# EAGLE design VSCard (EAGLE 8.3.1)
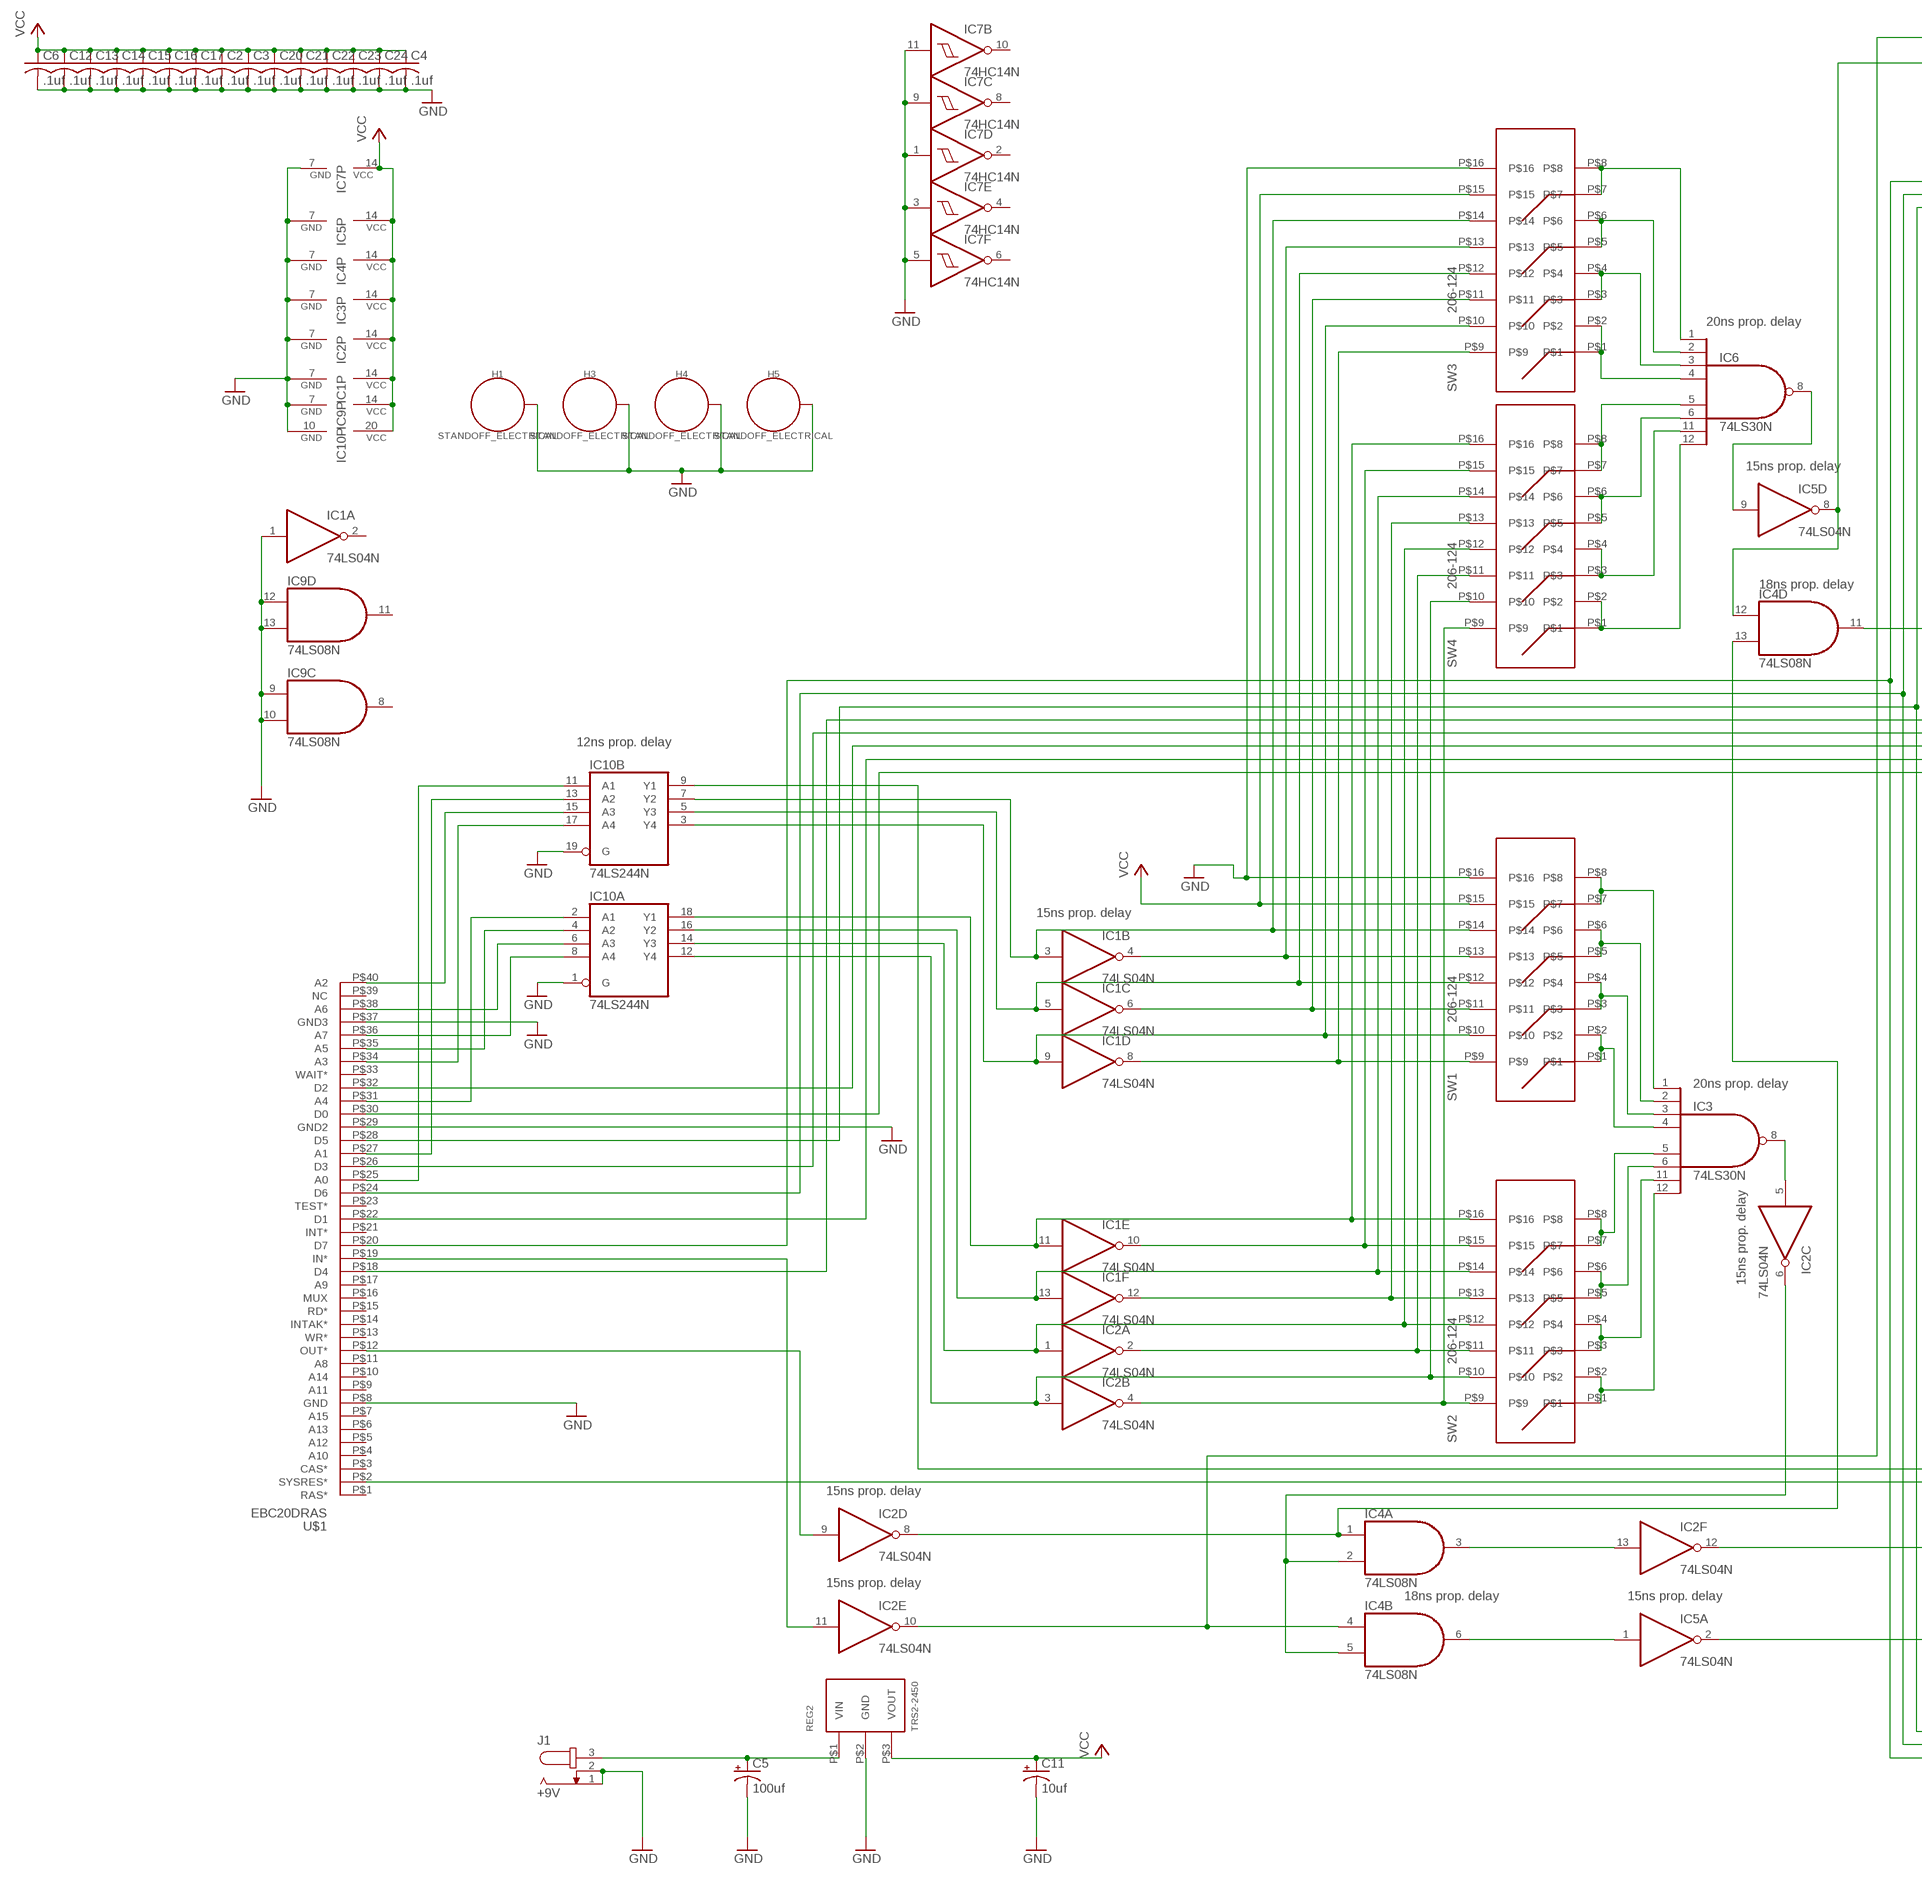
[diagram p0: schematic, sheet 1, part 1 of 3]
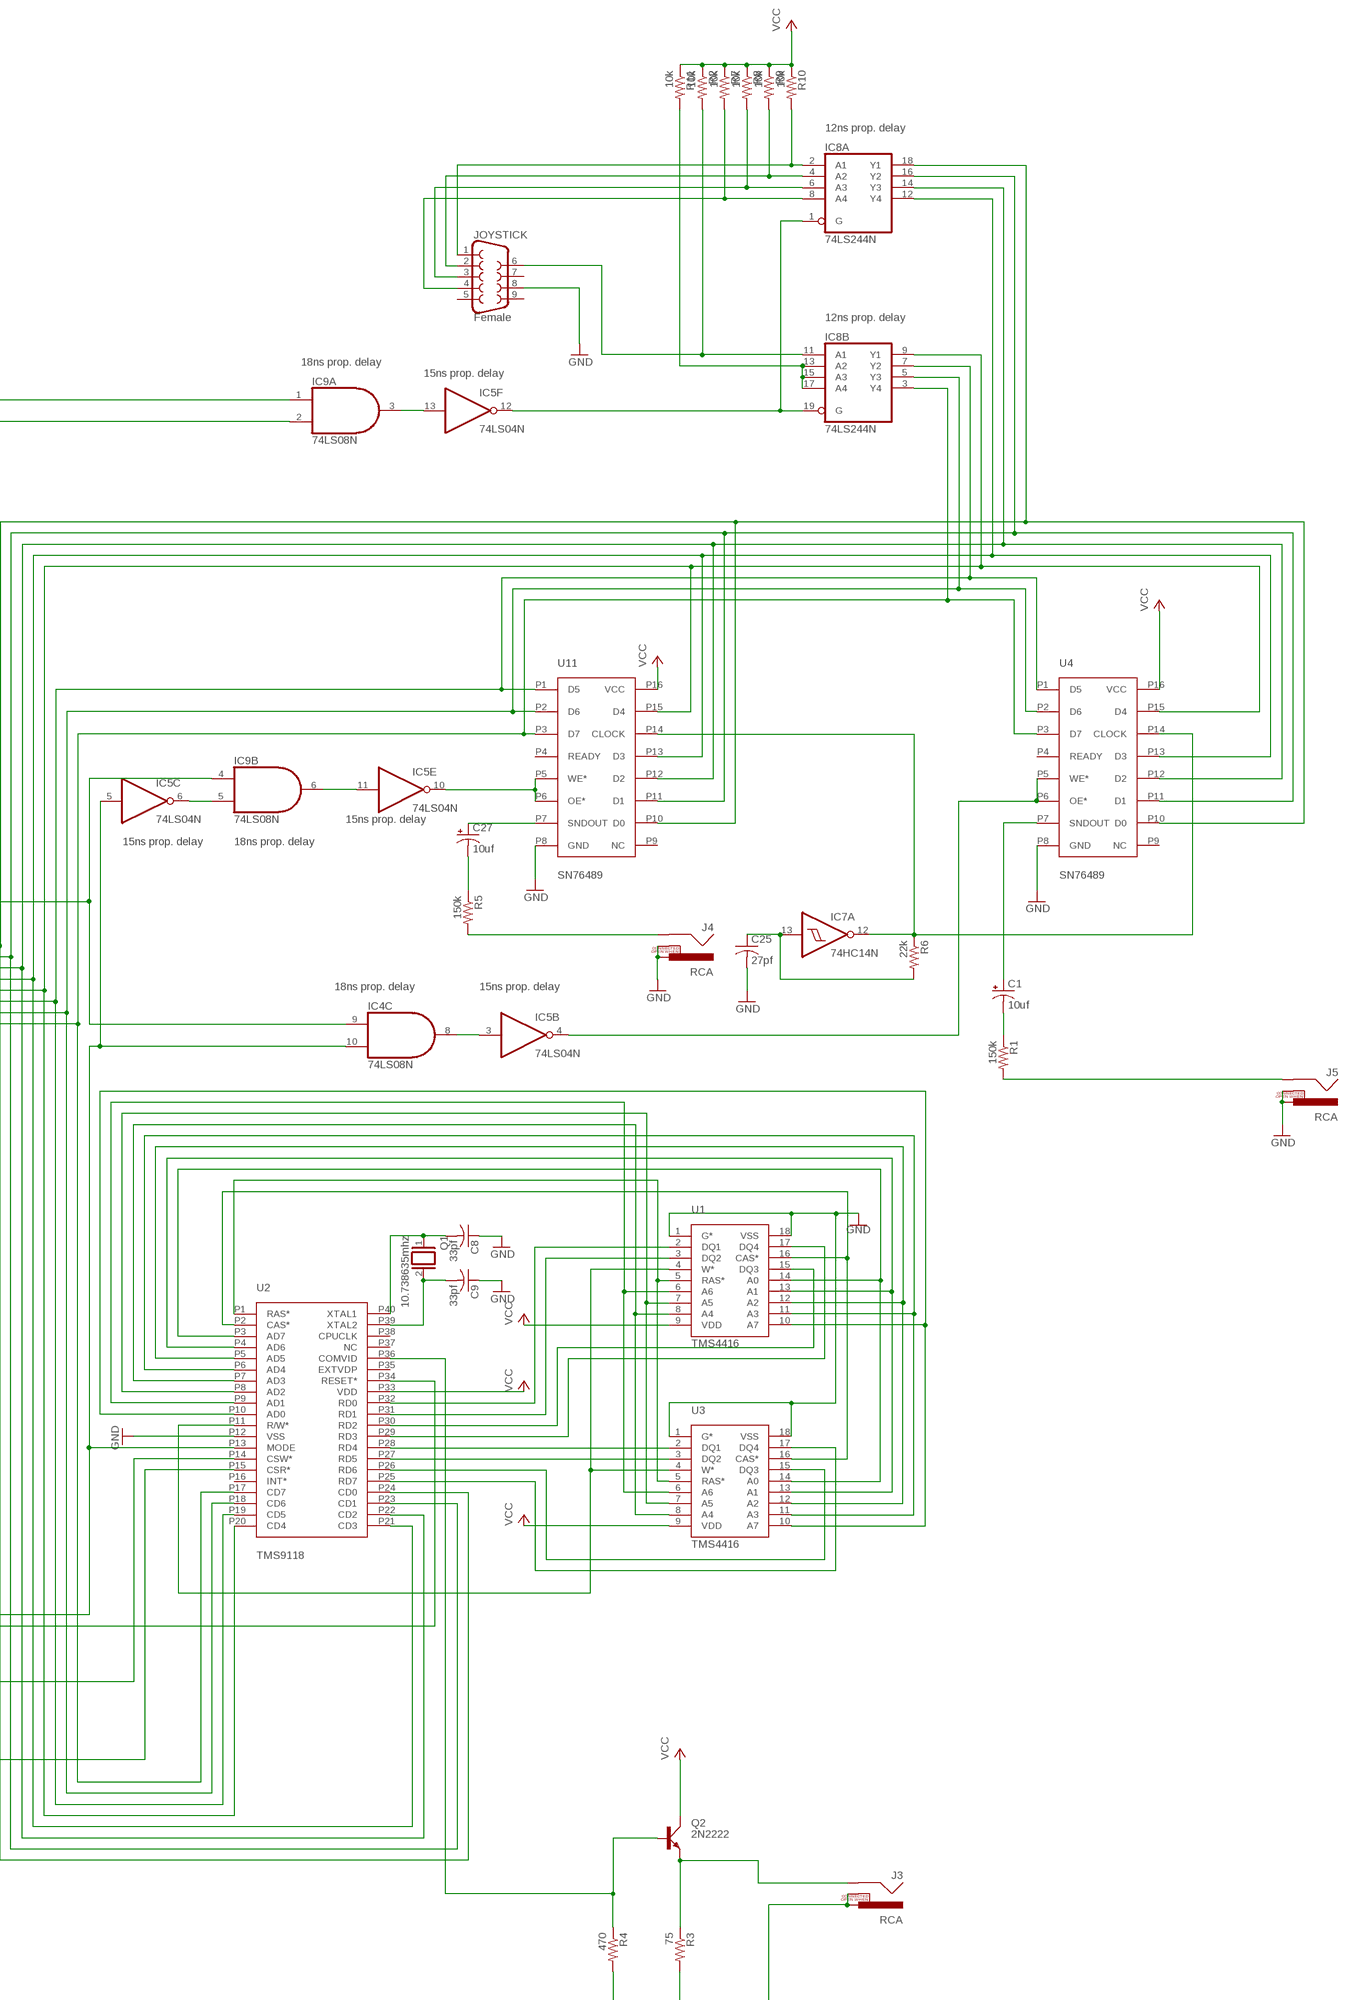
[diagram p1: schematic, sheet 1, part 2 of 3]
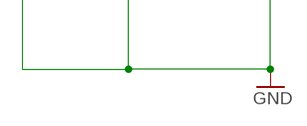
[diagram p2: schematic, sheet 1, part 3 of 3]

## Parts
C1  10uf  CPOL-USE2.5-6  [E2,5-6]
C2  .1uf  C-US025-025X050  [C025-025X050]
C3  .1uf  C-US025-025X050  [C025-025X050]
C4  .1uf  C-US025-025X050  [C025-025X050]
C5  100uf  CPOL-USE3.5-10  [E3,5-10]
C6  .1uf  C-US025-025X050  [C025-025X050]
C8  33pf  C-US050-050X075  [C050-050X075]
C9  33pf  C-US050-050X075  [C050-050X075]
C11  10uf  CPOL-USE3.5-10  [E3,5-10]
C12  .1uf  C-US025-025X050  [C025-025X050]
C13  .1uf  C-US025-025X050  [C025-025X050]
C14  .1uf  C-US025-025X050  [C025-025X050]
C15  .1uf  C-US025-025X050  [C025-025X050]
C16  .1uf  C-US025-025X050  [C025-025X050]
C17  .1uf  C-US025-025X050  [C025-025X050]
C20  .1uf  C-US025-025X050  [C025-025X050]
C21  .1uf  C-US025-025X050  [C025-025X050]
C22  .1uf  C-US025-025X050  [C025-025X050]
C23  .1uf  C-US025-025X050  [C025-025X050]
C24  .1uf  C-US025-025X050  [C025-025X050]
C25  27pf  C-US025-025X050  [C025-025X050]
C27  10uf  CPOL-USE2.5-6  [E2,5-6]
H1  STANDOFF_ELECTRICAL  [STANDOFF-ELECTRICAL]
H3  STANDOFF_ELECTRICAL  [STANDOFF-ELECTRICAL]
H4  STANDOFF_ELECTRICAL  [STANDOFF-ELECTRICAL]
H5  STANDOFF_ELECTRICAL  [STANDOFF-ELECTRICAL]
IC1  74LS04N  [DIL14]
IC2  74LS04N  [DIL14]
IC3  74LS30N  [DIL14]
IC4  74LS08N  [DIL14]
IC5  74LS04N  [DIL14]
IC6  74LS30N  [DIL14]
IC7  74HC14N  [DIL14]
IC8  74LS244N  [DIL20]
IC9  74LS08N  [DIL14]
IC10  74LS244N  [DIL20]
J1  +9V  JACK-PLUG0  [SPC4077]
J3  RCA  [RCA]
J4  RCA  [RCA]
J5  RCA  [RCA]
JOYSTICK  Female  DB9FEMALE  [DB9]
Q1  10.738635mhz  XTAL/S  [QS]
Q2  2N2222  [TO18A]
R1  150k  R-US_0207/2V  [0207/2V]
R2  10k  R-US_0207/2V  [0207/2V]
R3  75  R-US_0207/2V  [0207/2V]
R4  470  R-US_0207/2V  [0207/2V]
R5  150k  R-US_0207/2V  [0207/2V]
R6  22k  R-US_0207/2V  [0207/2V]
R7  10k  R-US_0207/2V  [0207/2V]
R8  10k  R-US_0207/2V  [0207/2V]
R9  10k  R-US_0207/2V  [0207/2V]
R10  10k  R-US_0207/2V  [0207/2V]
R11  10k  R-US_0207/2V  [0207/2V]
REG2  TRS2-2450  [TRACON_REG]
SW1  206-124  [206-124]
SW2  206-124  [206-124]
SW3  206-124  [206-124]
SW4  206-124  [206-124]
U1  TMS4416  [DIP18]
U2  TMS9118  [DIP40_MCU]
U3  TMS4416  [DIP18]
U4  SN76489  [DIP16]
U11  SN76489  [DIP16]
U$1  EBC20DRAS  [EBC20DRAS]

## Nets
A0: IC10.11(B:A1) U$1.P$25(A0)
A0(*): IC5.6(C:O) IC9.5(B:I1)
A0-SETTING: IC6.1(I0) SW3.P$7 SW3.P$8
A0-VDP-SETTING: IC3.1(I0) SW1.P$7 SW1.P$8
A0_BUFFERED: IC4.10(C:I1) IC5.5(C:I) IC10.9(B:Y1) U2.P13(MODE)
A1: IC10.13(B:A2) U$1.P$27(A1)
A1(*): IC1.4(B:O) SW1.P$13 SW3.P$13
A1-SETTING: IC6.2(I1) SW3.P$5 SW3.P$6
A1-VDP-SETTING: IC3.2(I1) SW1.P$5 SW1.P$6
A1_BUFFERED: IC1.3(B:I) IC10.7(B:Y2) SW1.P$14 SW3.P$14
A2: IC10.15(B:A3) U$1.P$40(A2)
A2(*): IC1.6(C:O) SW1.P$11 SW3.P$11
A2-SETTING: IC6.3(I2) SW3.P$3 SW3.P$4
A2-VDP-SETTING: IC3.3(I2) SW1.P$3 SW1.P$4
A2_BUFFERED: IC1.5(C:I) IC10.5(B:Y3) SW1.P$12 SW3.P$12
A3: IC10.17(B:A4) U$1.P$34(A3)
A3(*): IC1.8(D:O) SW1.P$9 SW3.P$9
A3-SETTING: IC6.4(I3) SW3.P$1 SW3.P$2
A3-VDP-SETTING: IC3.4(I3) SW1.P$1 SW1.P$2
A3_BUFFERED: IC1.9(D:I) IC10.3(B:Y4) SW1.P$10 SW3.P$10
A4: IC10.2(A:A1) U$1.P$31(A4)
A4(*): IC1.10(E:O) SW2.P$15 SW4.P$15
A4-SETTING: IC6.5(I4) SW4.P$7 SW4.P$8
A4-VDP-SETTING: IC3.5(I4) SW2.P$7 SW2.P$8
A4_BUFFERED: IC1.11(E:I) IC10.18(A:Y1) SW2.P$16 SW4.P$16
A5: IC10.4(A:A2) U$1.P$35(A5)
A5(*): IC1.12(F:O) SW2.P$13 SW4.P$13
A5-SETTING: IC6.6(I5) SW4.P$5 SW4.P$6
A5-VDP-SETTING: IC3.6(I5) SW2.P$5 SW2.P$6
A5_BUFFERED: IC1.13(F:I) IC10.16(A:Y2) SW2.P$14 SW4.P$14
A6: IC10.6(A:A3) U$1.P$38(A6)
A6(*): IC2.2(A:O) SW2.P$11 SW4.P$11
A6-SETTING: IC6.11(I6) SW4.P$3 SW4.P$4
A6-VDP-SETTING: IC3.11(I6) SW2.P$3 SW2.P$4
A6_BUFFERED: IC2.1(A:I) IC10.14(A:Y3) SW2.P$12 SW4.P$12
A7: IC10.8(A:A4) U$1.P$36(A7)
A7(*): IC2.4(B:O) SW2.P$9 SW4.P$9
A7-SETTING: IC6.12(I7) SW4.P$1 SW4.P$2
A7-VDP-SETTING: IC3.12(I7) SW2.P$1 SW2.P$2
A7_BUFFERED: IC2.3(B:I) IC10.12(A:Y4) SW2.P$10 SW4.P$10
COMVID: Q2.B R4.1 U2.P36(COMVID)
COMVID-OUT: J3.SHELL Q2.E R3.1
D0: IC8.3(B:Y4) U2.P17(CD7) U4.P3(D7) U11.P3(D7) U$1.P$30(D0)
D1: IC8.5(B:Y3) U2.P18(CD6) U4.P2(D6) U11.P2(D6) U$1.P$22(D1)
D2: IC8.7(B:Y2) U2.P19(CD5) U4.P1(D5) U11.P1(D5) U$1.P$32(D2)
D3: IC8.9(B:Y1) U2.P20(CD4) U4.P15(D4) U11.P15(D4) U$1.P$26(D3)
D4: IC8.12(A:Y4) U2.P21(CD3) U4.P13(D3) U11.P13(D3) U$1.P$18(D4)
D5: IC8.14(A:Y3) U2.P22(CD2) U4.P12(D2) U11.P12(D2) U$1.P$28(D5)
D6: IC8.16(A:Y2) U2.P23(CD1) U4.P11(D1) U11.P11(D1) U$1.P$24(D6)
D7: IC8.18(A:Y1) U2.P24(CD0) U4.P10(D0) U11.P10(D0) U$1.P$20(D7)
DOWN: IC8.4(A:A2) JOYSTICK.2 R9.2
GND: C2.2 C3.2 C4.2 C5.- C6.2 C8.1 C9.1 C11.- C12.2 C13.2 C14.2 C15.2 C16.2 C17.2 C20.2 C21.2 C22.2 C23.2 C24.2 C25.2 H1.P1 H3.P1 H4.P1 H5.P1 IC1.1(A:I) IC1.7(P:GND) IC2.7(P:GND) IC3.7(GND) IC4.7(P:GND) IC5.7(P:GND) IC7.1(D:I) IC7.3(E:I) IC7.5(F:I) IC7.7(P:GND) IC7.9(C:I) IC7.11(B:I) IC9.7(P:GND) IC9.9(C:I0) IC9.10(C:I1) IC9.12(D:I0) IC9.13(D:I1) IC10.1(A:G) IC10.10(P:GND) IC10.19(B:G) J1.1 J1.2 J3.PIN J3.SWITCH J4.PIN J4.SWITCH J5.PIN J5.SWITCH JOYSTICK.8 R3.2 R4.2 REG2.P$2(GND) SW1.P$16 SW3.P$16 U1.1(G*) U1.18(VSS) U2.P12(VSS) U3.1(G*) U3.18(VSS) U4.P8(GND) U11.P8(GND) U$1.P$8(GND) U$1.P$29(GND2) U$1.P$37(GND3)
IN: IC2.10(E:O) IC4.4(B:I0) IC9.1(A:I0)
IN(*): IC2.11(E:I) U$1.P$19(IN*)
LEFT: IC8.6(A:A3) JOYSTICK.3 R8.2
N$18: U1.5(RAS*) U2.P1(RAS*) U3.5(RAS*)
N$21: U1.16(CAS*) U2.P2(CAS*) U3.16(CAS*)
N$64: C27.- R5.1
N$65: J4.SHELL R5.2
N$88: C25.1 IC7.13(A:I) R6.2
N$94: C1.- R1.1
N$95: J5.SHELL R1.2
N$99: IC8.13(B:A2) IC8.15(B:A3) IC8.17(B:A4) R11.2
OUT: IC2.8(D:O) IC4.1(A:I0) IC4.13(D:I1)
OUT(*): IC2.9(D:I) U$1.P$12(OUT*)
RIGHT: IC8.8(A:A4) JOYSTICK.4 R7.2
SN76489-CLOCK: IC7.12(A:O) R6.1 U4.P14(CLOCK) U11.P14(CLOCK)
SND_JOY_ADDR: IC4.12(D:I0) IC5.8(D:O) IC9.2(A:I1)
SND_JOY_ADDR(*): IC5.9(D:I) IC6.8(O)
SND_JOY_ADDR_AND_IN: IC5.13(F:I) IC9.3(A:O)
SND_JOY_ADDR_AND_IN(*): IC5.12(F:O) IC8.1(A:G) IC8.19(B:G)
SND_JOY_ADDR_AND_OUT: IC4.9(C:I0) IC4.11(D:O) IC9.4(B:I0)
SND_JOY_ADDR_AND_OUT_AND_A0: IC4.8(C:O) IC5.3(B:I)
SND_JOY_ADDR_AND_OUT_AND_A0(*): IC5.4(B:O) U4.P5(WE*) U4.P6(OE*)
SND_JOY_ADDR_AND_OUT_AND_NOT_A0: IC5.11(E:I) IC9.6(B:O)
SND_JOY_ADDR_AND_OUT_AND_NOT_A0(*): IC5.10(E:O) U11.P5(WE*) U11.P6(OE*)
SNDOUT1: C27.+ U11.P7(SNDOUT)
SNDOUT2: C1.+ U4.P7(SNDOUT)
SYSRES(*): U2.P34(RESET*) U$1.P$2(SYSRES*)
TMS9118_RW(*)_TMS4416_W(*): U1.4(W*) U2.P11(R/W*) U3.4(W*)
TMS9918_AD0-TMS4416_A7: U1.10(A7) U2.P10(AD0) U3.10(A7)
TMS9918_AD1-TMS4416_A6: U1.6(A6) U2.P9(AD1) U3.6(A6)
TMS9918_AD2-TMS4416_A5: U1.7(A5) U2.P8(AD2) U3.7(A5)
TMS9918_AD3-TMS4416_A4: U1.8(A4) U2.P7(AD3) U3.8(A4)
TMS9918_AD4-TMS4416_A3: U1.11(A3) U2.P6(AD4) U3.11(A3)
TMS9918_AD5-TMS4416_A2: U1.12(A2) U2.P5(AD5) U3.12(A2)
TMS9918_AD6-TMS4416_A1: U1.13(A1) U2.P4(AD6) U3.13(A1)
TMS9918_AD7-TMS4416_A0: U1.14(A0) U2.P3(AD7) U3.14(A0)
TRIGGER: IC8.11(B:A1) JOYSTICK.6 R2.2
UP: IC8.2(A:A1) JOYSTICK.1 R10.2
VCC: C2.1 C3.1 C4.1 C6.1 C11.+ C12.1 C13.1 C14.1 C15.1 C16.1 C17.1 C20.1 C21.1 C22.1 C23.1 C24.1 IC1.14(P:VCC) IC2.14(P:VCC) IC3.14(VCC) IC4.14(P:VCC) IC5.14(P:VCC) IC7.14(P:VCC) IC9.14(P:VCC) IC10.20(P:VCC) Q2.C R2.1 R7.1 R8.1 R9.1 R10.1 R11.1 REG2.P$3(VOUT) SW1.P$15 SW3.P$15 U1.9(VDD) U2.P33(VDD) U3.9(VDD) U4.P16(VCC) U11.P16(VCC)
VDP-RD0: U1.2(DQ1) U2.P32(RD0)
VDP-RD1: U1.3(DQ2) U2.P31(RD1)
VDP-RD2: U1.15(DQ3) U2.P30(RD2)
VDP-RD3: U1.17(DQ4) U2.P29(RD3)
VDP-RD4: U2.P28(RD4) U3.2(DQ1)
VDP-RD5: U2.P27(RD5) U3.3(DQ2)
VDP-RD6: U2.P26(RD6) U3.15(DQ3)
VDP-RD7: U2.P25(RD7) U3.17(DQ4)
VDP_ADDR: IC2.6(C:O) IC4.2(A:I1) IC4.5(B:I1)
VDP_ADDR(*): IC2.5(C:I) IC3.8(O)
VDP_ADDR_AND_IN: IC4.6(B:O) IC5.1(A:I)
VDP_ADDR_AND_IN(*): IC5.2(A:O) U2.P15(CSR*)
VDP_ADDR_AND_OUT: IC2.13(F:I) IC4.3(A:O)
VDP_ADDR_AND_OUT(*): IC2.12(F:O) U2.P14(CSW*)
VOLTAGE-IN: C5.+ J1.3 REG2.P$1(VIN)
XTAL1: C8.2 Q1.1 U2.P40(XTAL1)
XTAL2: C9.2 Q1.2 U2.P39(XTAL2)
Unconnected: IC1.2(A:O) IC7.2(D:O) IC7.4(E:O) IC7.6(F:O) IC7.8(C:O) IC7.10(B:O) IC9.8(C:O) IC9.11(D:O) JOYSTICK.5 JOYSTICK.7 JOYSTICK.9 U2.P16(INT*) U2.P35(EXTVDP) U2.P37(NC) U2.P38(CPUCLK) U4.P4(READY) U4.P9(NC) U11.P4(READY) U11.P9(NC) U$1.P$1(RAS*) U$1.P$3(CAS*) U$1.P$4(A10) U$1.P$5(A12) U$1.P$6(A13) U$1.P$7(A15) U$1.P$9(A11) U$1.P$10(A14) U$1.P$11(A8) U$1.P$13(WR*) U$1.P$14(INTAK*) U$1.P$15(RD*) U$1.P$16(MUX) U$1.P$17(A9) U$1.P$21(INT*) U$1.P$23(TEST*) U$1.P$33(WAIT*) U$1.P$39(NC)

## Notes on the sheet
- 12ns prop. delay
- 12ns prop. delay
- 18ns prop. delay
- 15ns prop. delay
- 20ns prop. delay
- 15ns prop. delay
- 15ns prop. delay
- 15ns prop. delay | 18ns prop. delay
- 18ns prop. delay
- 18ns prop. delay | 15ns prop. delay
- 12ns prop. delay
- 15ns prop. delay
- 20ns prop. delay
- 15ns prop. delay
- 15ns prop. delay
- 15ns prop. delay
- 18ns prop. delay | 15ns prop. delay

## Power pins joined to a net without a drawn wire
GND: IC6.7(GND) IC8.10(P:GND)
VCC: IC6.14(VCC) IC8.20(P:VCC)

## Library data of the parts
C1 C27 = resistor:CPOL-US: POLARIZED CAPACITOR, American symbol
C2-C4 C6 C12-C17 C20-C25 = resistor:C-US: CAPACITOR, American symbol
C5 C11 = rcl:CPOL-US: POLARIZED CAPACITOR, American symbol
C8 C9 = rcl:C-US: CAPACITOR, American symbol
H1 H3-H5 = SparkFun-Hardware:STANDOFF_ELECTRICAL: Stand Off Drill holes with an electrical connection. For example, use these to ground your board to a chassis. Example SparkFun Products Screw - Phillips Head (1/4", 4-40, 10 pack) <https://www.sparkfun.com/products/10453> (PRT-10453) Screw - Phillips Head (1/2", 4-40, 10 pack) <https://www.sparkfun.com/products/10452> (PRT-10452) Screw - Phillips Head (3/4", 4-40, 10 pack) <https://www.sparkfun.com/products/10451> (PRT-10451) Screw - Phillips Head (1", 4-40, 10 pack) <https://www.sparkfun.com/products/10450> (PRT-10450)
IC1 IC2 IC5 = 74xx-us:74*04: Hex INVERTER
IC3 IC6 = 74xx-us:74*30: 8-input NAND gate
IC4 IC9 = 74xx-us:74*08: Quad 2-input AND gate
IC7 = 74xx-eu:74*14: Hex schmitt trigger INVERTER
IC8 IC10 = 74xx-us:74*244: Octal BUFFER and LINE DRIVER, 3-state
J1 = con-jack:JACK-PLUG: DC POWER JACK Power Jack, DC, Right Angle, Through Hole, Rated 5A at 16VDC, PC Terminals Distributor: Farnell (www.Farnell.de) Drawing: 84N1161.pdf / 84N1162.pdf Manufacturer: SPC Technology (www.spctechnology.com) Type: SPC4077 / SPC 4078; OC_FARNELL: unknown; OC_NEWARK: unknown
J3-J5 = SparkFun-Connectors:RCA: RCA Jack connector This is a right angle RCA jack connecotr. Commonly used for video or audio. Here is the connector we sell at SparkFun: RCA Jack <https://www.sparkfun.com/products/8631> (PRT-08631) Datasheet <http://www.sparkfun.com/datasheets/Prototyping/Connectors/RCA-Jack.pdf> It is not used on any active designs, however it was used on a couple retired products: RCA Jack Breakout [RETIRED] <https://www.sparkfun.com/products/8826> (PRT-08826) SparkFun On Screen Display Breakout - MAX7456 [RETIRED] <https://www.sparkfun.com/products/9168> (BOB-09168) You may also be interested in a cable: RCA Video Cable - 6' <https://www.sparkfun.com/products/11573> (CAB-11573); PROD_ID: CONN-09081; SF_ID: PRT-08631
JOYSTICK = SparkFun-Connectors:DB9: DB9 Connector Standard DB9 (D-Sub 9) serial connector. Can be used for CAN bus as well as RS485 and RS232. Footprint production proven. Here is the female version connector we sell at SparkFun: 9 Pin Female Serial Connector - PCB Mount <https://www.sparkfun.com/products/429> (PRT-00429) This connector has been used on the following SparkFun products: SparkFun RS232 Shifter - SMD <https://www.sparkfun.com/products/449> (PRT-00449) SparkFun RS232 Shifter SMD (No DB9) <https://www.sparkfun.com/products/8780> (PRT-08780); PROD_ID: CONN-08194
Q1 = special:XTAL/S: CRYSTAL
Q2 = transistor-small-signal:2N2222: NPN TRANSISTOR
R1-R11 = resistor:R-US_: RESISTOR, American symbol
REG2 = TMS99:TRS2-2450: 5V TRACO regulator
SW1-SW4 = TMS99:206-124: 206-124 CTS SPDT Dip Switch
U1 U3 = TMS99:TMS4416: TMS4416
U2 = TMS99:TMS9118: TMS9118
U4 U11 = TMS99:SN76489: SN76489 Sound Chip
U$1 = TMS99:EBC20DRAS

## Board
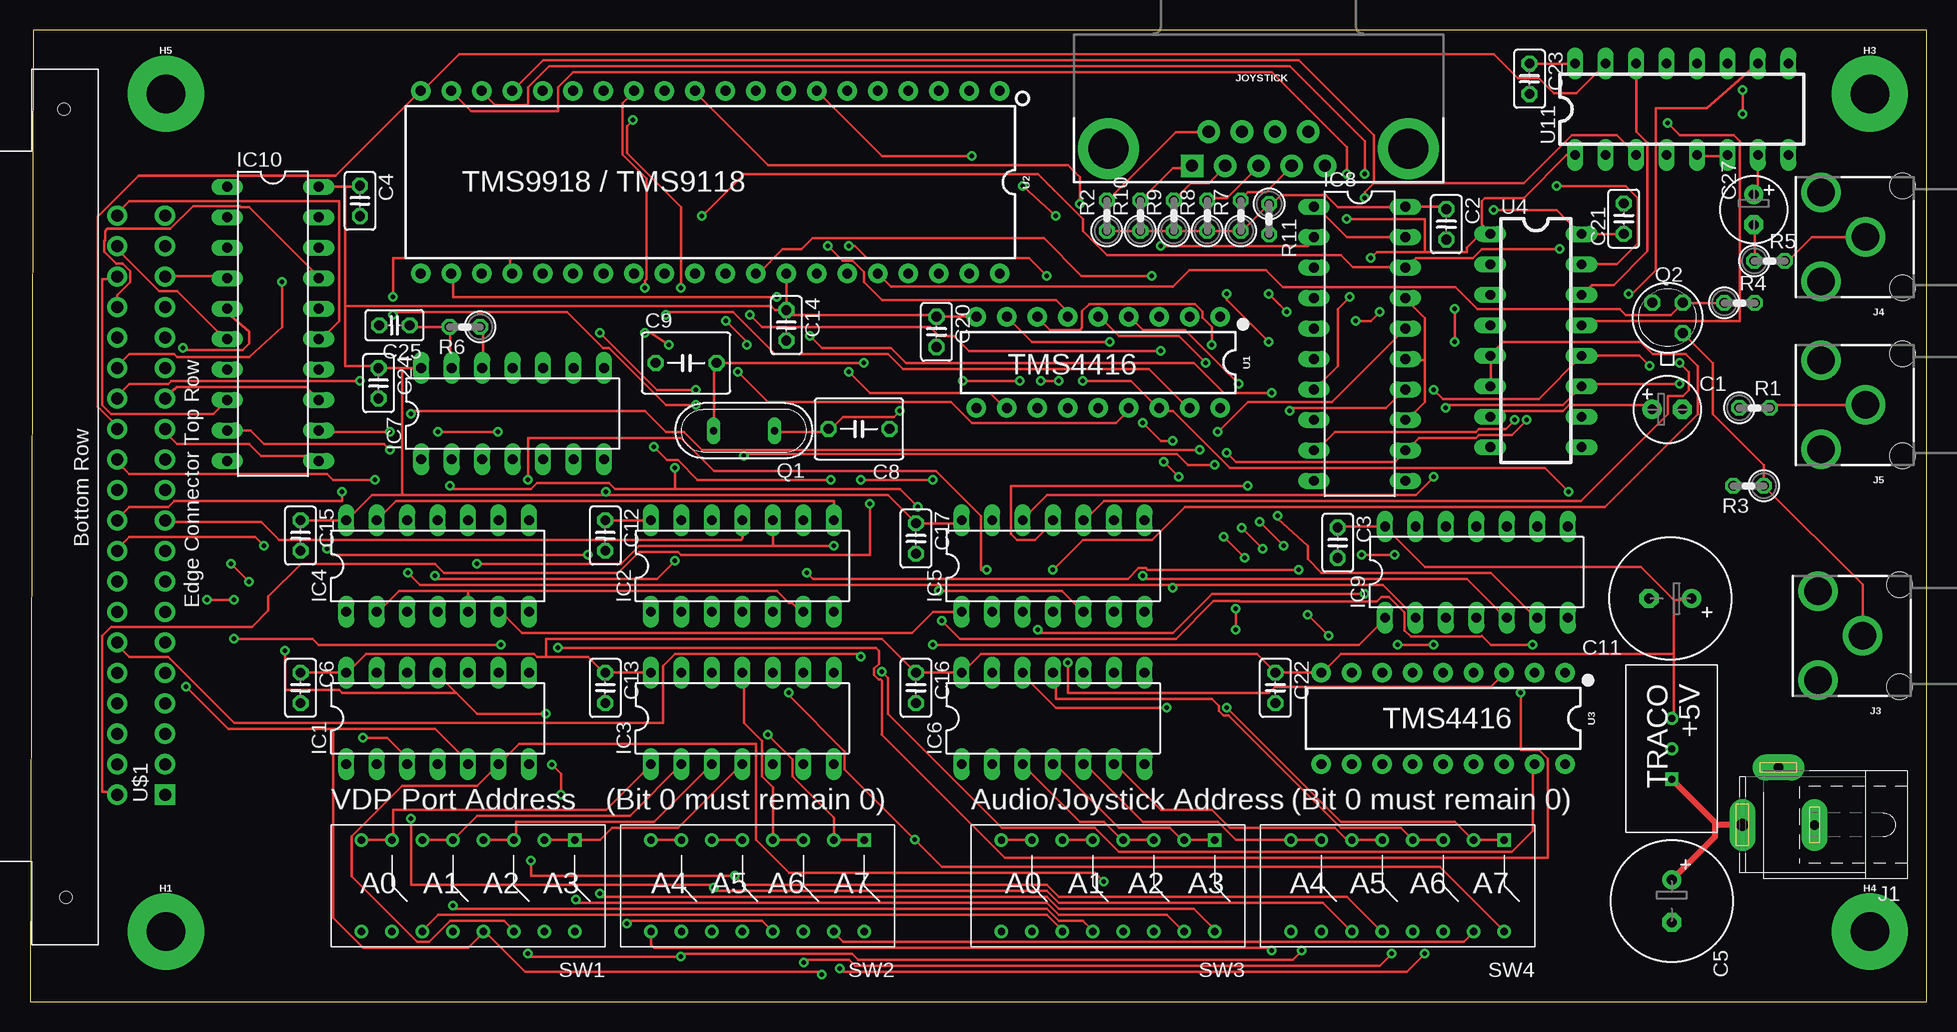
[diagram p3: board, top side]
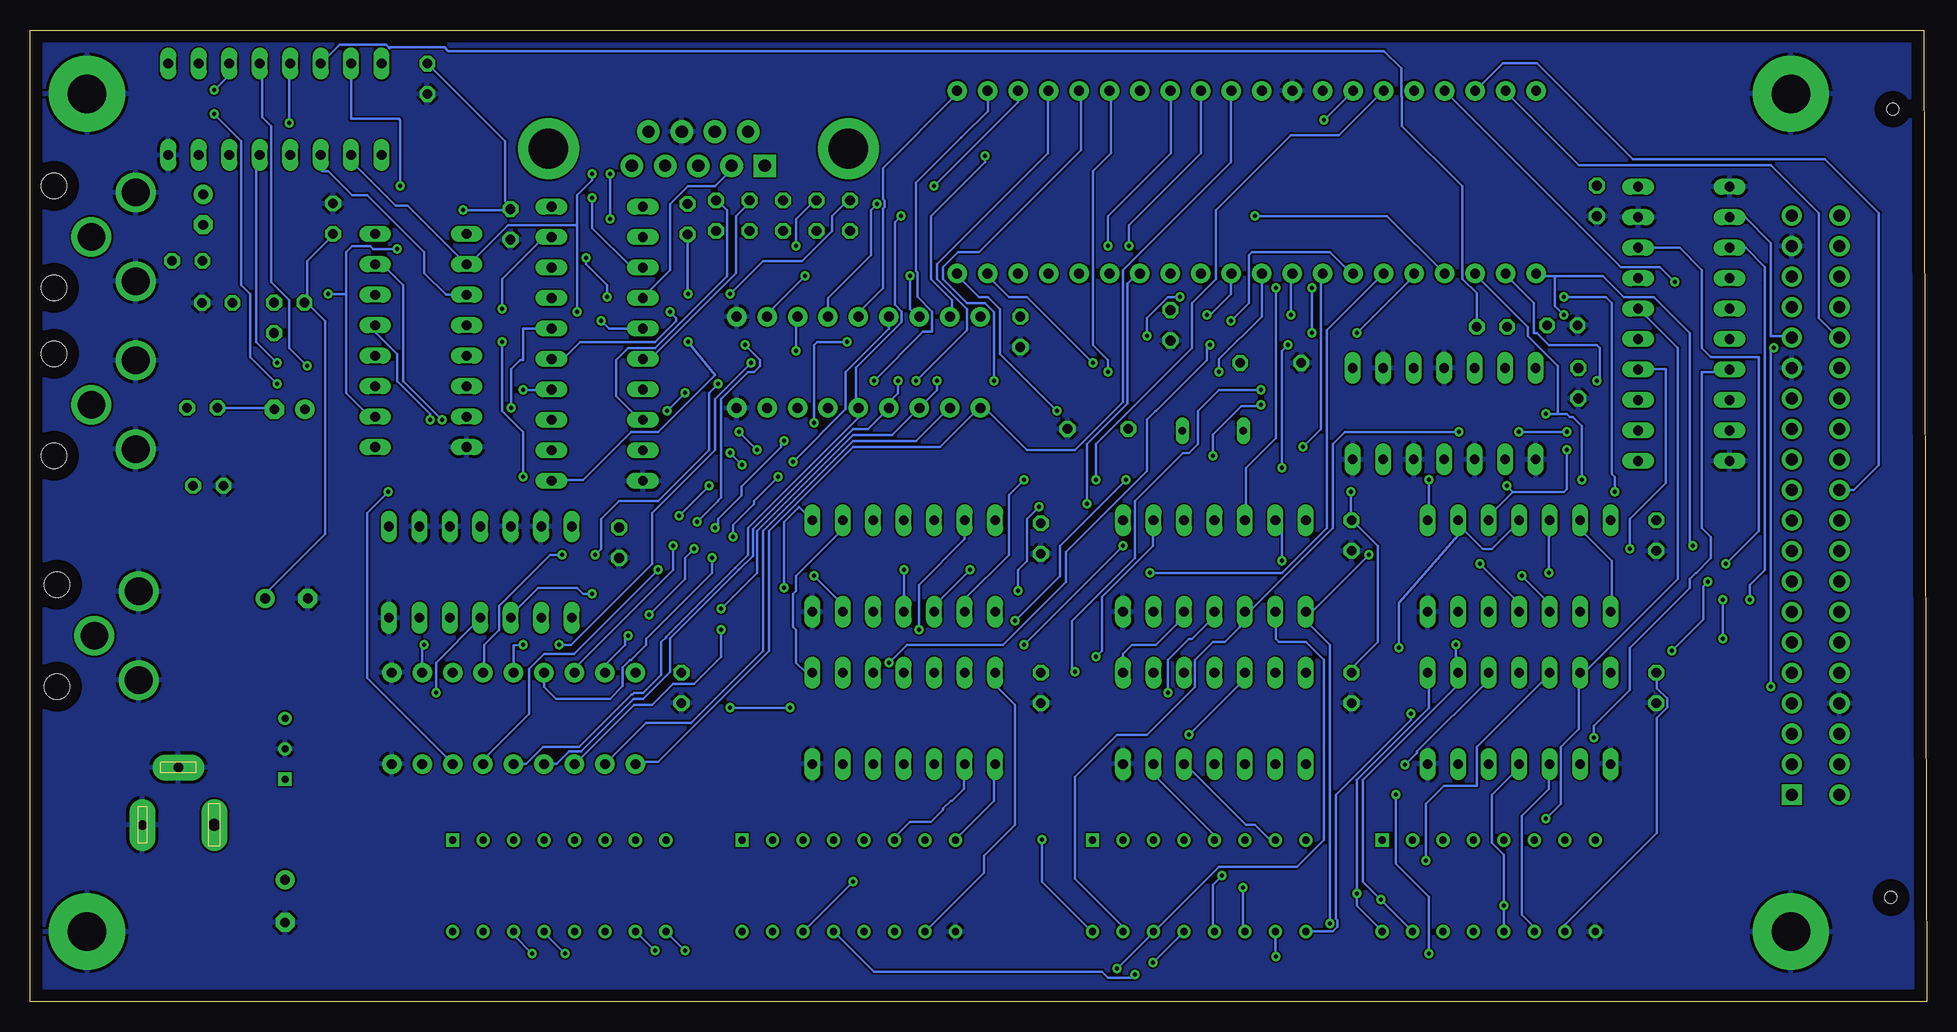
[diagram p4: board, bottom side, seen from below]

Size 158.11 x 81 mm. Coordinates in mm from the lower left corner, seen from the top.
Outline: 0,0 158.11,0 158.11,81 0.25,81 0,0
Copper layers (1*16): Top 0.035mm / dielectric 1.5mm / Bottom 0.035mm
Design rules "default *": minimum track width 0.2mm, minimum drill 0.35mm, track to track 6mil, track to pad 6mil, pad to pad 6mil, via to via 6mil, smd to smd 6mil, copper to edge 40mil, drill to drill 6mil, minimum pad ring 10mil, minimum via ring 8mil, stop-mask expansion 4mil, vias tented up to drill 0mil, thermal gap 10mil

### Footprints (pad centres in the part's own frame; a part is rotated, then mirrored left to right if it is on the bottom)
E2,5-6 = drill 0.813 pad 1.6: + -1.27,0 | drill 0.813 pad 1.6 octagon: - 1.27,0
C025-025X050 = drill 0.813 octagon: 1 -1.27,0; 2 1.27,0
E3,5-10 = drill 0.813 pad 1.6: + -1.778,0 | drill 0.813 pad 1.6 octagon: - 1.778,0
C050-050X075 = drill 0.813 octagon: 1 -2.54,0; 2 2.54,0
STANDOFF-ELECTRICAL = drill 3.2 pad 6.35: P1 0,0
DIL14 = drill 0.813 long: 1 -7.62,-3.81; 2 -5.08,-3.81; 3 -2.54,-3.81; 4 0,-3.81; 5 2.54,-3.81; 6 5.08,-3.81; 7 7.62,-3.81; 8 7.62,3.81; 9 5.08,3.81; 10 2.54,3.81; 11 0,3.81; 12 -2.54,3.81; 13 -5.08,3.81; 14 -7.62,3.81
DIL20 = drill 0.813 long: 1 -11.43,-3.81; 2 -8.89,-3.81; 3 -6.35,-3.81; 4 -3.81,-3.81; 5 -1.27,-3.81; 6 1.27,-3.81; 7 3.81,-3.81; 8 6.35,-3.81; 9 8.89,-3.81; 10 11.43,-3.81; 11 11.43,3.81; 12 8.89,3.81; 13 6.35,3.81; 14 3.81,3.81; 15 1.27,3.81; 16 -1.27,3.81; 17 -3.81,3.81; 18 -6.35,3.81; 19 -8.89,3.81; 20 -11.43,3.81
SPC4077 = drill 0.8 pad 2.184 long: 1 -3,0; 2 0,-4.8 | drill 1 pad 2.184 long: 3 3,0
RCA = drill 2.3: PIN 3.7,3.7; SHELL 0,0; SWITCH 3.7,-3.7 | hole 2.1: -3.1,4.25; -3.1,-4.25
DB9 = drill 1.016 pad 1.88 square: 1 -5.54,-1.42 | drill 1.016 pad 1.88: 2 -2.77,-1.42; 3 0,-1.42; 4 2.77,-1.42; 5 5.54,-1.42; 6 -4.15,1.42; 7 -1.38,1.42; 8 1.38,1.42; 9 4.15,1.42 | drill 3.302 pad 5.08: G1 -12.5,0; G2 12.5,0
QS = drill 0.61 long: 1 -2.54,0; 2 2.54,0
TO18A = drill 0.813 octagon: B 1.27,-1.27; C 1.27,1.27; E -1.27,-1.27
0207/2V = drill 0.813 octagon: 1 -1.27,0; 2 1.27,0
TRACON_REG = drill 0.6 square: P$1 0,0 | drill 0.6: P$2 2.54,0; P$3 5.08,0
206-124 = drill 0.6 square: P$1 0,0 | drill 0.6: P$2 2.54,0; P$3 5.08,0; P$4 7.62,0; P$5 10.16,0; P$6 12.7,0; P$7 15.24,0; P$8 17.78,0; P$9 0,7.62; P$10 2.54,7.62; P$11 5.08,7.62; P$12 7.62,7.62; P$13 10.16,7.62; P$14 12.7,7.62; P$15 15.24,7.62; P$16 17.78,7.62
DIP18 = drill 0.813 pad 1.626: 1 -10.16,-3.81; 2 -7.62,-3.81; 3 -5.08,-3.81; 4 -2.54,-3.81; 5 0,-3.81; 6 2.54,-3.81; 7 5.08,-3.81; 8 7.62,-3.81; 9 10.16,-3.81; 10 10.16,3.81; 11 7.62,3.81; 12 5.08,3.81; 13 2.54,3.81; 14 0,3.81; 15 -2.54,3.81; 16 -5.08,3.81; 17 -7.62,3.81; 18 -10.16,3.81
DIP40_MCU = drill 0.813 pad 1.626: P1 -24.13,-7.62; P2 -21.59,-7.62; P3 -19.05,-7.62; P4 -16.51,-7.62; P5 -13.97,-7.62; P6 -11.43,-7.62; P7 -8.89,-7.62; P8 -6.35,-7.62; P9 -3.81,-7.62; P10 -1.27,-7.62; P11 1.27,-7.62; P12 3.81,-7.62; P13 6.35,-7.62; P14 8.89,-7.62; P15 11.43,-7.62; P16 13.97,-7.62; P17 16.51,-7.62; P18 19.05,-7.62; P19 21.59,-7.62; P20 24.13,-7.62; P21 24.13,7.62; P22 21.59,7.62; P23 19.05,7.62; P24 16.51,7.62; P25 13.97,7.62; P26 11.43,7.62; P27 8.89,7.62; P28 6.35,7.62; P29 3.81,7.62; P30 1.27,7.62; P31 -1.27,7.62; P32 -3.81,7.62; P33 -6.35,7.62; P34 -8.89,7.62; P35 -11.43,7.62; P36 -13.97,7.62; P37 -16.51,7.62; P38 -19.05,7.62; P39 -21.59,7.62; P40 -24.13,7.62
DIP16 = drill 0.813 long: P1 -8.89,-3.81; P2 -6.35,-3.81; P3 -3.81,-3.81; P4 -1.27,-3.81; P5 1.27,-3.81; P6 3.81,-3.81; P7 6.35,-3.81; P8 8.89,-3.81; P9 8.89,3.81; P10 6.35,3.81; P11 3.81,3.81; P12 1.27,3.81; P13 -1.27,3.81; P14 -3.81,3.81; P15 -6.35,3.81; P16 -8.89,3.81
EBC20DRAS = drill 1 pad 1.676 square: P$1 0,0 | drill 1 pad 1.676: P$2 0,3.969; P$3 2.54,0; P$4 2.54,3.969; P$5 5.08,0; P$6 5.08,3.969; P$7 7.62,0; P$8 7.62,3.969; P$9 10.16,0; P$10 10.16,3.969; P$11 12.7,0; P$12 12.7,3.969; P$13 15.24,0; P$14 15.24,3.969; P$15 17.78,0; P$16 17.78,3.969; P$17 20.32,0; P$18 20.32,3.969; P$19 22.86,0; P$20 22.86,3.969; P$21 25.4,0; P$22 25.4,3.969; P$23 27.94,0; P$24 27.94,3.969; P$25 30.48,0; P$26 30.48,3.969; P$27 33.02,0; P$28 33.02,3.969; P$29 35.56,0; P$30 35.56,3.969; P$31 38.1,0; P$32 38.1,3.969; P$33 40.64,0; P$34 40.64,3.969; P$35 43.18,0; P$36 43.18,3.969; P$37 45.72,0; P$38 45.72,3.969; P$39 48.26,0; P$40 48.26,3.969 | hole 1: -8.572,8.255; 57.15,8.414

### Placement (x,y rotation side)
C1  136.47,49.37 0 top
C2  118.06,64.8 270 top
C3  109,38.25 270 top
C4  27.5,66.75 270 top
C5  136.85,8.37 270 top
C6  22.55,26.15 270 top
C8  69.1,47.74 180 top
C9  54.69,53.24 0 top
C11  136.73,33.6 180 top
C12  47.95,38.85 270 top
C13  47.95,26.15 270 top
C14  63.05,56.38 270 top
C15  22.55,38.85 270 top
C16  73.85,26.15 270 top
C17  73.85,38.6 270 top
C20  75.56,55.83 270 top
C21  132.85,65.27 90 top
C22  103.81,26.15 270 top
C23  124.99,76.93 270 top
C24  29.05,51.55 270 top
C25  30.38,56.38 180 top
C27  143.68,66.03 270 top
H1  11.33,5.83 0 top
H3  153.36,75.68 0 top
H4  153.36,5.83 0 top
H5  11.33,75.68 0 top
IC1  33.98,23.61 0 top
IC2  59.38,36.31 0 top
IC3  59.38,23.61 0 top
IC4  33.98,36.31 0 top
IC5  85.28,36.31 0 top
IC6  85.28,23.61 0 top
IC7  40.23,49.01 0 top
IC8  110.83,54.84 270 top
IC9  120.57,35.8 0 top
IC10  20.25,56.5 270 top
J1  145.74,14.72 180 top
J3  152.75,30.5 180 top
J4  153,63.75 180 top
J5  153,49.75 180 top
JOYSTICK  102.4,71.1 0 top
Q1  59.52,47.59 180 top
Q2  136.5,57 90 top
R1  143.75,49.5 0 top
R2  89.76,65.52 90 top
R3  143.25,43 180 top
R4  142.5,58.25 0 top
R5  145,61.75 0 top
R6  36.25,56.25 180 top
R7  100.92,65.52 90 top
R8  98.13,65.52 90 top
R9  95.34,65.52 90 top
R10  92.55,65.52 90 top
R11  103.29,65.23 270 top
REG2  136.85,18.53 90 top
SW1  45.41,13.45 180 top
SW2  69.54,13.45 180 top
SW3  98.75,13.45 180 top
SW4  122.88,13.45 180 top
U1  89.05,53.29 180 top
U2  56.7,68.31 180 top
U3  117.8,23.61 180 top
U4  125.53,55.11 270 top
U11  137.69,74.39 0 top
U$1  11.25,17.25 90 top

### Tracks (layer width: path | path; a pad name or v marks a point on that pad's centre or on a via)
A0
  Top 0.2: IC10.11 24,45.25 23.75,45.5 19.25,45.5 18.25,46.5 12.25,46.5 11.25,47.5 U$1.P$25
A0(*)  (via drill 0.35)
  Top 0.2: v92.75,35.5 93,35.25 119.75,35.25 123,32 IC9.5
  Bottom 0.2: v92.75,35.5 90.5,33.25 90.5,32.5 IC5.6
A0-SETTING
  Top 0.2: SW3.P$8 81,13.5 83.5,13.5 SW3.P$7
  Bottom 0.2: IC6.1 77.75,19.75 77.75,16.75 81,13.5 SW3.P$8
A0-VDP-SETTING
  Top 0.2: SW1.P$8 27.75,13.5 30,13.5 SW1.P$7 30.25,13.5 30.25,16 48,16 51.75,19.75 IC3.1
A0_BUFFERED  (via drill 0.35)
  Top 0.2: v74,41.25 72.5,42.75 53.75,42.75 | 53.75,42.75 48.75,42.75 48.25,43.25 42.25,43.25 41.75,42.75 35.25,42.75 v35,43 | IC5.5 87.75,32.5 86,34.25 v75.75,34.25 | 53.75,42.75 v53.75,44.5 | v51.25,55.75 51.75,55.75 v53.25,54.75 | v51.25,59.5 51.25,60.08 51.41,60.25 51.41,68.59 49.4,70.6 49.4,74.9 50.35,75.85 U2.P13 | IC10.9 18.39,47.61 19.5,46.5 29.5,46.5 v30,46
  Bottom 0.2: 34.5,42.5 36.75,40.25 IC4.10 | v74,41.25 75,40.25 75,36.75 75.75,36 v75.75,34.25 | 34.5,42.5 v35,43 | v51.25,55.75 v51.25,59.5 | v53.75,44.5 53.75,54.25 v53.25,54.75 | v30,46 30,42.75 30.25,42.5 34.5,42.5
A1
  Top 0.2: IC10.13 24,50.25 23,51.25 12.23,51.25 11.9,50.92 | 11.9,50.92 12,51.02 | 11.9,50.92 U$1.P$27
A1(*)  (via drill 0.35)
  Top 0.2: v35.25,8 35.5,7.75 84.75,7.75 85.75,6.75 87.75,6.75 88.5,6 SW3.P$13
  Bottom 0.2: SW1.P$13 v35.25,8 35.25,12.25 36.25,13.25 36.25,17.25 33.75,19.75 IC1.4
A1-SETTING
  Top 0.2: SW3.P$6 86.25,13.5 88.5,13.5 SW3.P$5
  Bottom 0.2: 86,13.5 SW3.P$6 86.05,13.7 84.75,15 83,15 82,16 82,16.09 81.34,16.75 81.25,16.75 80.25,17.75 80.25,19.75 IC6.2
A1-VDP-SETTING
  Top 0.2: 35.25,13.5 32.75,13.5 SW1.P$6 | IC3.2 50,15.5 37.25,15.5 35.25,13.5 | 35.25,13.5 SW1.P$5
A1_BUFFERED  (via drill 0.35)
  Top 0.2: SW1.P$14 32.75,6 34,7.25 84.75,7.25 86,6 SW3.P$14 | IC1.3 31.44,20.31 29.75,22 v27.75,22
  Bottom 0.2: IC1.3 31.5,19.75 31.5,17.75 33.75,15.5 33.75,7.25 32.5,6 SW1.P$14 | IC10.7 16.63,52.5 18.75,52.5 18.75,39.5 18,38.75 18,36.97 19.22,35.75 19.25,35.75 19.75,35.25 19.75,34.5 24.75,29.5 24.75,26 27.75,23 v27.75,22
A2
  Top 0.2: IC10.15 24.25,55.25 25.75,56.75 25.75,66.75 8.25,66.75 7.25,65.75 U$1.P$40
A2(*)  (via drill 0.35)
  Top 0.2: SW1.P$11 40.25,6 39.5,6.75 35,6.75 33.25,5 32.25,5 26.83,10.42 26.83,13.11 26.82,13.12 26.82,13.78 31.04,18 37.25,18 39,19.75 IC1.6 39.25,20 40.75,21.5 60.5,21.5 60.5,13.5 63.25,10.75 88.75,10.75 v89.5,10
  Bottom 0.2: v89.5,10 SW3.P$11
A2-SETTING
  Top 0.2: SW3.P$3 93.5,13.5 91.25,13.5 SW3.P$4 91,13.5 89.5,15 87.5,15 82.75,19.75 IC6.3
A2-VDP-SETTING
  Top 0.2: SW1.P$4 38,13.5 40.25,13.5 SW1.P$3 | IC3.3 56.75,19.75 52,15 40.5,15 40.5,13.62 SW1.P$3 | 40.5,13.5 SW1.P$3
A2_BUFFERED  (via drill 0.35)
  Top 0.2: 25.25,22.75 25.25,7 27.75,4.5 36.5,4.5 37.75,5.75 SW1.P$12 38,5.75 41.25,2.5 65.75,2.5 v66,2.25 | 25.25,22.75 33.75,22.75 36.5,20 IC1.5 | v13,26.25 16.5,22.75 25.25,22.75 | 16.5,57.75 IC10.5 16.44,57.43 18.26,55.86 18.26,54.85 17.73,54.32 12.9,54.32 12.72,54.5 v12.75,54.5
  Bottom 0.2: SW3.P$12 91,5.75 87.75,2.5 68.75,2.5 68.25,2 66.25,2 v66,2.25 | v13,26.25 13,54.25 v12.75,54.5
A3
  Top 0.2: IC10.17 24.06,60.44 18.25,66.25 17.53,66.25 17.48,66.3 13.59,66.3 11.7,64.42 6.75,64.42 | 6.75,64.42 6.67,64.42 | U$1.P$34 7.28,58.89 8.37,59.98 8.37,60.88 7.73,61.52 7.19,61.52 6.19,62.52 6.19,63.42 6.25,63.48 6.25,64.25 6.42,64.42 6.75,64.42
A3(*)  (via drill 0.35)
  Top 0.2: v47.5,9 47.75,8.75 84.75,8.75 85.75,7.75 97,7.75 98.75,6 SW3.P$9
  Bottom 0.2: SW1.P$9 45.5,6 47.5,8 v47.5,9 47.5,18.5 41.5,24.5 41.5,27.25 IC1.8
A3-SETTING
  Top 0.2: SW3.P$1 98.75,13.5 96.25,13.5 SW3.P$2 96,13.5 95,14.5 90.75,14.5 85.5,19.75 IC6.4
A3-VDP-SETTING
  Top 0.2: SW1.P$2 43,13.5 45.25,13.5 SW1.P$1 45.5,13.5 47.5,13.5 48.5,14.5 54,14.5 59.25,19.75 IC3.4
A3_BUFFERED  (via drill 0.35)
  Top 0.2: SW3.P$10 96,6 94.75,7.25 85.75,7.25 84.75,8.25 45.75,8.25 v45.5,8.5 | v14.75,33.5 v17,33.5 | v17,30.25 23.56,30.25 24.06,29.75 v39.25,29.75
  Bottom 0.2: SW1.P$10 43,6 v45.5,8.5 47,10 47,18.5 39.25,26.25 39.25,27.25 IC1.9 39.25,27.5 v39.25,29.75 | 16.25,62.75 IC10.3 15.1,62.85 13.5,61.25 13.5,59.81 | 13.5,59.81 13.5,36 14.75,34.75 v14.75,33.5 | 13.5,59.81 13.5,60 | v17,30.25 v17,33.5
A4
  Bottom 0.2: U$1.P$31 11.4,55.5 13,55.5 13,63.25 15.14,65.39 IC10.2
A4(*)  (via drill 0.35)
  Top 0.2: v106,4.25 105.25,3.5 69,3.5 68.5,4 54.14,4 54.25,3.89 v54.25,3.75 41.75,3.75 v41.5,4 | v43.5,19.75 44.25,19 v44.25,17.25
  Bottom 0.2: v106,4.25 107.5,5.75 SW4.P$15 | 36.75,27.25 IC1.10 36.52,26.83 42.51,20.84 42.51,20.74 v43.5,19.75 | v41.5,4 41.5,8.75 44.25,11.5 v44.25,17.25 | SW2.P$15 54.3,3.8 v54.25,3.75
A4-SETTING
  Top 0.2: SW4.P$7 107.5,13.5 105.25,13.5 SW4.P$8 105,13.5 100.5,13.5 99,15 92.75,15 88,19.75 IC6.5
A4-VDP-SETTING
  Top 0.2: SW2.P$8 52,13.5 54.25,13.5 SW2.P$7
  Bottom 0.2: IC3.5 61.75,19.75 56.75,14.75 56,14.75 54.5,13.25 SW2.P$7
A4_BUFFERED  (via drill 0.35)
  Top 0.2: v103.5,4.25 103.25,4.5 52,4.5 51.76,4.74 SW2.P$16 | 35.5,25.75 37.25,24 v43,24 | 35.5,25.75 34,27.25 IC1.11 | v21.25,29.25 21.25,26 25.75,26 26,25.75 35.5,25.75 | v18.25,35 v16.75,36.5
  Bottom 0.2: v103.5,4.25 105,5.75 SW4.P$16 | v43,24 43,23.5 49.25,17.25 49.25,6.89 49.12,6.76 49.12,6.24 49.49,5.87 51.72,5.87 SW2.P$16 | 24,62.75 IC10.18 20.6,62.85 18.75,61 18.75,54.5 18,53.75 14,53.75 14,39.25 v16.75,36.5 | v21.25,29.25 18.63,31.87 18.63,34.62 v18.25,35
A5
  Top 0.2: IC10.4 16.25,60.5 11.25,60.5 U$1.P$35
A5(*)  (via drill 0.35)
  Top 0.2: v58.75,10.5 59,10.25 | SW4.P$13 112.5,6 109.75,8.75 85.75,8.75 84.75,9.75 59.5,9.75 v58.75,10.5 | v41.75,11.75 41.75,10.5 v58.75,10.5
  Bottom 0.2: SW2.P$13 59.5,6 59.5,9.75 v58.75,10.5 | IC1.12 31.5,27.25 37.5,21.25 37.5,18 40.25,18 41.75,16.5 v41.75,11.75
A5-SETTING
  Top 0.2: SW4.P$5 112.5,13.5 110.25,13.5 SW4.P$6 110,13.5 109.75,13.5 108.75,14.5 100,14.5 98.5,16 94.25,16 90.5,19.75 IC6.6
A5-VDP-SETTING
  Top 0.2: SW2.P$6 57,13.5 59.25,13.5 SW2.P$5
  Bottom 0.2: IC3.6 64.25,19.75 64.25,18.75 59.5,14 59.5,13.5 SW2.P$5
A5_BUFFERED  (via drill 0.35)
  Top 0.2: SW4.P$14 110,6 107.75,8.25 85.75,8.25 84.75,9.25 57.25,9.25 v57,9.5 56.75,9.75 31.75,9.75 v31.75,15.25
  Bottom 0.2: IC10.16 24,57.75 20.75,54.5 20.75,35.25 28.75,27.25 IC1.13 29,27.25 29,22.75 30.5,21.25 30.5,16.5 v31.75,15.25 | v57,9.5 57,6 SW2.P$14
A6
  Top 0.2: IC10.6 16.25,55.25 12.25,59.25 10.75,59.25 7.25,62.75 U$1.P$38
A6(*)  (via drill 0.35)
  Top 0.2: v67.5,2.75 67.75,2.5 114.76,2.5 116.25,3.99 v116.25,4
  Bottom 0.2: v67.5,2.75 64.5,5.75 SW2.P$11 64.25,6 59,11.25 52.5,11.25 50.25,13.5 50.25,28.5 51.75,30 54,30 54.25,30.25 54.25,32.45 IC2.2 54.25,32.5 | SW4.P$11 117.8,5.55 v116.25,4
A6-SETTING
  Top 0.2: SW4.P$3 117.75,13.5 115.5,13.5 SW4.P$4 115.25,13.5 114.25,14.5 109.25,14.5 99.88,23.87 99.49,23.87 99.12,24.24 99.12,24.63 98.5,25.25 85.5,25.25 85.5,27.25 IC6.11
A6-VDP-SETTING
  Top 0.2: SW2.P$3 64.25,13.5 62,13.5 SW2.P$4 61.92,17.85 61.01,18.76 61.01,21.74 59.5,23.25 59.5,27.3 IC3.11
A6_BUFFERED  (via drill 0.35)
  Top 0.2: SW2.P$12 61,6.75 50,6.75 v49.75,6.5 | v113.5,4 112.5,3 68.75,3 68.25,3.5 64.75,3.5 v64.5,3.25 | v24.75,37.75 25.25,37.25 v46.5,37.25
  Bottom 0.2: 51.75,32 IC2.1 51.75,32 | 51.75,32 51.75,31.75 49.75,29.75 v49.75,6.5 | v113.5,4 115.25,5.75 SW4.P$12 | v64.5,3.25 SW2.P$12 | v24.75,37.75 24.75,40.25 21.75,43.25 21.75,52.75 24,52.75 IC10.14 | 51.75,32 v46.5,37.25
A7
  Top 0.2: IC10.8 16.25,50 15.25,49 6.75,49 6,49.75 6,60.25 7.25,60.25 U$1.P$36
A7(*)  (via drill 0.35)
  Top 0.2: SW4.P$9 122.75,6 117.5,11.25 76,11.25 v73.75,13.5 67.91,19.34 67.91,20.84 63.25,25.5 v63.25,25.75
  Bottom 0.2: 69.75,6 SW2.P$9 69.58,5.83 73.75,10 v73.75,13.5 | v63.25,25.75 63.25,28.5 61.5,30.25 61.25,30.25 59.5,32 59.5,32.41 59.41,32.5 | 59.41,32.5 59.5,32.5 | 59.41,32.5 IC2.4
A7-SETTING  (via drill 0.35)
  Top 0.2: SW4.P$1 122.75,13.5 120.5,13.5 SW4.P$2 120.25,13.5 118.75,15 109.25,15 v99.75,24.5 | v94.75,24.5 85.5,24.5 82.75,27.25 IC6.12
  Bottom 0.2: v99.75,24.5 v94.75,24.5
A7-VDP-SETTING  (via drill 0.35)
  Top 0.2: SW2.P$1 69.5,13.5 67,13.5 SW2.P$2 67,15.31 63.55,18.76 63.55,20.2 v61.5,22.25
  Bottom 0.2: v61.5,22.25 57,26.75 57,27.25 IC3.12
A7_BUFFERED  (via drill 0.35)
  Top 0.2: SW2.P$10 67,5.75 67.75,5 119.5,5 120.25,5.75 SW4.P$10 | v30,47.5 24.25,47.5 IC10.12 | v39,47.5 v34,47.5
  Bottom 0.2: SW2.P$10 67,6.25 71,10.25 71,18.75 67.5,22.25 65,22.25 61,26.25 61,28.5 59.5,30 58.5,30 57.25,31.25 57.25,32.12 56.87,32.5 | 56.87,32.5 57,32.5 | 56.87,32.5 IC2.3 56.5,32.5 49.5,39.5 49.5,46.5 48.5,47.5 v39,47.5 | v30,47.5 v34,47.5
COMVID
  Top 0.2: R4.1 138,58.25 Q2.B 136.75,57.25 133,57.25 132.5,57.75 120.64,57.75 118.83,59.56 104.44,59.56 103,61 96.64,61 95.27,59.62 71.77,59.62 70.7,60.69 U2.P36
COMVID-OUT
  Top 0.2: Q2.E 140.25,53.25 140.25,49 144.52,44.73 R3.1 152.75,34.77 J3.SHELL
D0  (via drill 0.35)
  Top 0.2: 112,68.25 124.5,68.25 128.5,72.25 132.25,72.25 133.75,70.75 U11.P3 | U2.P17 40.25,76 42.75,78.5 105.75,78.5 112,72.25 112,68.25 | v21,60 21,56.25 18.25,53.75 12.25,53.75 12,54 8.25,54 7.25,53 U$1.P$30 | v111.25,67 111.25,67.5 112,68.25
  Bottom 0.2: 107.25,61.25 IC8.3 107.94,61.19 111.25,64.5 v111.25,67 | 133.75,70.5 U11.P3 133.88,69.38 133.75,69.25 133.25,69.25 131.25,67.25 130,67.25 125.25,62.5 125.25,60.75 123.42,58.92 U4.P3 | U2.P17 40,75.75 25.5,61.25 22.25,61.25 v21,60
D1  (via drill 0.35)
  Top 0.2: v111.25,69 111.25,71.75 105,78 43.25,78 41.5,76.25 41.5,74.75 38.75,74.75 37.75,75.75 U2.P18 | v110.5,56.75 111.75,56.75 v112.5,57.5
  Bottom 0.2: 107.75,56.25 107.25,56.25 107.16,56.2 | 107.16,56.2 IC8.5 109.86,56.11 v110.5,56.75 | 107.22,56.25 107.16,56.2 | v111.25,69 111.25,68.5 112.5,67.25 112.5,64.73 | 112.5,64.73 v112.5,57.5 | 112.5,64.73 112.52,64.75 118.25,64.75 121.5,61.5 U4.P2 121.75,61.5 126.62,66.37 127.62,66.37 131.25,70 131.25,70.49 U11.P2 | U$1.P$22 6.1,42.65 4,44.75 4,65.75 8.5,70.25 24.5,70.25 32.5,78.25 35.33,78.25 U2.P18
D2  (via drill 0.35)
  Top 0.2: v111.75,62 112.25,62.5 116.25,62.5 | IC8.7 107.25,51.25 109,53 109,57.75 v110,58.75 | 128.75,70.5 U11.P1 128.08,70.58 124.5,67 121.25,67 121,66.75 121,64.76 121.33,64.42 | 116.25,62.5 116.25,65.25 v109.75,65.25 | U2.P19 35.25,75.75 36.75,74.25 44,74.25 44,76.25 45.25,77.5 103.5,77.5 109.75,71.25 v109.75,69 | U4.P1 121.72,64.04 121.33,64.42 | 121.33,64.42 119.75,62.84 119.75,62.5 116.25,62.5
  Bottom 0.2: v111.75,62 111.75,61.5 110,59.75 v110,58.75 | U2.P19 35,75.75 29,69.75 13,69.75 9,65.75 9,57 7.25,55.25 U$1.P$32 | v109.75,69 v109.75,65.25
D3  (via drill 0.35)
  Top 0.2: v123.75,48.5 123,47.75 120.75,47.75 120.5,47.5 108.75,47.5 107.25,46 IC8.9 | U4.P15 129.38,61.5 132.25,61.5 134,63.25 134,67 133,68 v127.25,68 | U11.P15 128.89,75.75 127,75.75 125.75,77 124,77 122,79 35.75,79 32.75,76 U2.P20 25.48,68.84 9.07,68.84 5.65,65.42 5.65,49.6 7.28,47.97 U$1.P$26
  Bottom 0.2: v123.75,48.5 127,51.75 127,59.75 128.5,61.25 129.25,61.25 U4.P15 | 131.25,78 U11.P15 131.34,73.59 127.34,73.59 127.25,73.5 v127.25,68
D4  (via drill 0.35)
  Top 0.2: v124.75,48.5 123.5,47.25 120.75,47.25 120.5,47 115.75,47 114.75,46 IC8.12 114.5,45.75 113.75,45 100.5,45 v99.75,45.75 | v136.5,73.25 137.5,72.25 142,72.25 142.5,71.75 142.5,56.75 129.75,56.75 129.5,56.5 U4.P13 | v30.25,57.25 30.5,57.5 44.75,57.5 47.75,54.5 48.25,54.5 53,49.75 v55.5,49.75 | v19.5,38 18.75,38.75 8.25,38.75 7.25,37.75 U$1.P$18 | v98.75,44.75 96.5,44.75 95.6,45.65 59.65,45.65 v59.5,45.5
  Bottom 0.2: 31,60.5 27,60.5 25.25,58.75 22.75,58.75 19.75,55.75 19.75,38.25 v19.5,38 | 31,60.5 32.5,60.5 U2.P21 | v124.75,48.5 124.75,49 127.5,51.75 127.5,54 129.25,55.75 129.25,56.25 U4.P13 | v136.5,73.25 136.5,78 U11.P13 | 31,60.5 31,58 v30.25,57.25 | v99.75,45.75 v98.75,44.75 | v59.5,45.5 59.5,47.25 57.13,49.63 55.62,49.63 v55.5,49.75
D5  (via drill 0.35)
  Top 0.2: v117,51 117.75,50.25 125.75,50.25 U4.P12 | 129.5,54 U4.P12 | v62.25,58.75 35.25,58.75 35.25,60.5 U2.P22 | v65,55.5 66,54.5 71.75,54.5 73,53.25 97,53.25 99.5,50.75 v103.5,50.75 | v105,49.25 105.25,49.5 113,49.5 114.5,51 IC8.14 | U4.P12 134.16,53.84 v135,53 | U$1.P$28 7.25,50.5 8.25,51.5 11.5,51.5 11.75,51.75 v27.5,51.75
  Bottom 0.2: U2.P22 35,60.5 32.75,58.25 32.75,55.75 32.5,55.75 31.5,54.75 27.5,54.75 27.25,54.5 27.25,52 v27.5,51.75 | v117,51 114.75,51 IC8.14 | U11.P12 138.75,78 138.75,73.75 138,73 138,60 136.5,58.5 136.5,54.5 v135,53 | v62.25,58.75 63.25,58.75 65,57 v65,55.5 | v105,49.25 v103.5,50.75
D6  (via drill 0.35)
  Top 0.2: v118,49.5 118.25,49.75 127.75,49.75 129.25,51.25 U4.P11 129.5,51.5 v137.5,51.5 | v97.5,46 56,46 54.5,47.5 53,47.5 51.25,49.25 32,49.25 v31.75,49 | v99,47.5 101.5,50 108.5,50 114.5,56 IC8.16 | v142.75,76 v142.75,74 | v28.75,43.5 25.25,43.5 24.75,44 8.25,44 7.25,45 U$1.P$24
  Bottom 0.2: U2.P23 37.5,60.5 33.25,56.25 33.25,55.5 30.75,53 30.75,49 | v118,49.5 118,52.75 117.25,53.5 117,53.5 117,56.11 IC8.16 | v137.5,51.5 139.75,53.75 139.75,59 140.5,59.75 140.5,71.75 v142.75,74 | v31.75,49 30.75,49 | v99,47.5 v97.5,46 | U11.P11 141.5,77.25 v142.75,76 | v28.75,43.5 28.75,48 29.5,48.75 29.75,48.75 30,49 30.75,49
D7  (via drill 0.35)
  Top 0.2: v30.25,58.75 30.25,62 40,62 40,60.75 U2.P24 | v127.5,62.75 121,62.75 120.25,62 115.5,62 114.75,61.25 IC8.18 114.5,61.25 110.25,61.25 109.25,62.25 89.75,62.25 87.75,64.25 87.75,65.25 84,69 59.5,69 v56,65.5 | 144,78 U11.P10 143.45,77.7 139.75,74.5 135.5,74.5 135.5,61 133.5,59 v133.25,59 | U$1.P$20 7.25,40.25 8.25,41.25 11.5,41.25 12,41.75 26,41.75 v26,42.5
  Bottom 0.2: 131.75,59 131.75,50.75 130,49 129.5,49 U4.P10 | 131.75,59 131.75,62.5 131.25,63 129.75,63 129.5,62.75 v127.5,62.75 | 131.75,59 v133.25,59 | v26,42.5 26,43.75 26.25,44 26.25,58.25 26.75,58.75 v30.25,58.75 | v56,65.5 45,65.5 U2.P24
DOWN
  Top 0.2: R9.2 95.5,67 96.75,68.25 98.25,68.25 99.5,69.5 JOYSTICK.2
  Bottom 0.2: IC8.4 107,58.75 104.75,61 104.75,66.5 103.25,68 101,68 99.5,69.5 JOYSTICK.2
GND
  pour Bottom: 0.5,0 158.22,0 157.72,81.49 0,81.49
IN  (via drill 0.35)
  Top 0.2: v37.25,36.5 49.25,36.5 50.75,38 62.01,38 | 62.01,38 v67,38 | v75.25,29.75 110.75,29.75 112.75,31.75 IC9.1 | IC2.10 61.92,38.09 62.01,38
  Bottom 0.2: v37.25,36.5 34,33.25 34,32.5 IC4.4 | v67,38 v75.25,29.75
IN(*)
  Top 0.2: U$1.P$19 11.25,40 19.25,40 20.75,38.5 59.25,38.5 59.38,38.63 IC2.11
LEFT
  Top 0.2: JOYSTICK.3 102.25,69.5 99.75,67 98.25,67 R8.2
  Bottom 0.2: IC8.6 107,53.75 106.25,53.75 99.25,60.75 99.25,65.5 98,66.75 R8.2
N$18  (via drill 0.35)
  Top 0.2: v98,53.25 95.75,55.5 90.75,55.5 89.25,57 U1.5 | v117,29.75 v114,29.75
  Bottom 0.2: v98,53.25 101,50.25 101,46 106.25,40.75 106.25,36.5 113,29.75 v114,29.75 | 117.75,27.5 U3.5 117.8,29.7 v117,29.75 | 81,75.75 U2.P1 80.83,75.67 87,69.5 87,66.89 86.87,66.76 86.87,66.24 87,66.11 87,59.5 89.25,57.25 U1.5
N$21  (via drill 0.35)
  Top 0.2: v128.25,42.5 126.25,44.5 100,44.5 95.25,49.25 94.25,49.25 U1.16 94,49.5 91.75,51.75 v87.75,51.75
  Bottom 0.2: v128.25,42.5 130,40.75 130,27 123,20 U3.16 | v87.75,51.75 83.66,55.84 82.91,55.84 82.91,57.54 84.12,58.76 84.12,60.76 84.25,60.89 84.25,68.25 80.5,72 78.25,74.25 78.25,75.89 U2.P2
N$64
  Top 0.2: R5.1 143.75,61.75 143.75,64.75 C27.-
N$65
  Top 0.2: J4.SHELL 148.5,63.75 146.5,61.75 R5.2
N$88
  Top 0.2: C25.1 31.75,56.25 R6.2 35,56.25 35,53 IC7.13
N$94
  Bottom 0.2: R1.1 137.75,49.5 C1.-
N$95
  Top 0.2: J5.SHELL 145.5,49.75 145.25,49.5 R1.2
N$99  (via drill 0.35)
  Top 0.2: 116.25,53.5 116.25,50 114.75,48.5 IC8.13 | 116.25,53.5 114.75,53.5 IC8.15 | 116.25,53.5 116.25,57 114.75,58.5 IC8.17 | v103.25,59 v104.75,57.5
  Bottom 0.2: IC8.15 114.5,53.75 113.5,53.75 112.25,55 106,55 104.25,56.75 104.25,57 v104.75,57.5 | R11.2 103.29,59.29 v103.25,59
OUT
  Top 0.2: IC4.13 29,40.25 30.5,41.75 67,41.75 IC2.8
  Bottom 0.2: IC4.1 26.25,32.5 26.25,36.75 28.75,39.25 28.75,40 IC4.13
OUT(*)  (via drill 0.35)
  Top 0.2: v69.25,28.75 69,29 53.75,29 52.75,28 52.75,23.25 17,23.25 11.5,28.75 8.25,28.75 7.25,29.75 U$1.P$12
  Bottom 0.2: IC2.9 64.5,40 64.5,38 68.75,33.75 68.75,29.25 v69.25,28.75
RIGHT
  Top 0.2: JOYSTICK.4 105,69.5 103,67.5 101.5,67.5 101,67 R7.2
  Bottom 0.2: IC8.8 107.25,48.5 109.25,50.5 109.25,53.5 108.25,54.5 106,54.5 100,60.5 100,66 100.75,66.75 R7.2
SN76489-CLOCK
  Top 0.2: IC7.12 37.75,53 37.75,56.25 R6.1 | U11.P14 133.88,72.53 134.79,71.62 134.79,62.54 132,59.75 130.17,59.75 U4.P14
  Bottom 0.2: R6.1 37.52,59.05 38.72,60.25 38.72,67.97 43.75,73 43.75,75.44 43.8,75.49 43.8,77.8 45.25,79.25 123.25,79.25 123.55,79.55 128.2,79.55 | 128.15,79.5 128.2,79.55 | 128.2,79.55 128.42,79.77 132.31,79.77 U11.P14
SND_JOY_ADDR  (via drill 0.35)
  Top 0.2: v31.5,35.75 32.5,34.75 95.25,34.75 | 95.25,34.75 112.75,34.75 IC9.2 | 95.25,34.75 v95.25,34.5
  Bottom 0.2: v31.5,35.75 31.5,40 IC4.12 | v95.25,34.5 95.25,40 94,41.25 94,41.22 IC5.8
SND_JOY_ADDR(*)
  Bottom 0.2: IC5.9 90.5,40 90.5,39.25 94.25,35.5 94.25,34.25 94.5,34 94.5,31.25 94.25,31 94.25,28.25 93.42,27.42 IC6.8
SND_JOY_ADDR_AND_IN  (via drill 0.35)
  Top 0.2: 84.11,30.75 95.25,30.75 98.5,34 v111.25,34 | 84.11,30.75 84,30.75 | v84,31 84,30.86 84.11,30.75
  Bottom 0.2: 80.25,40 IC5.13 80.2,38.55 84,34.75 v84,31 | IC9.3 118.25,32 115.75,34.5 112.5,34.5 112,34 v111.25,34
SND_JOY_ADDR_AND_IN(*)  (via drill 0.35)
  Top 0.2: v117,43.75 115.5,42.25 84.75,42.25 82.75,40.25 IC5.12 | IC8.1 107.25,66.25 109.75,63.75 114.5,63.75 IC8.19 | v118.75,57.75 v118.75,55
  Bottom 0.2: v117,43.75 117,47.5 118.75,49.25 v118.75,55 | IC8.19 114.75,63.5 115.5,63.5 118.75,60.25 v118.75,57.75
SND_JOY_ADDR_AND_OUT  (via drill 0.35)
  Top 0.2: v124.25,25.75 124.25,21 125.75,21 126.5,20.25 126.5,12 81.25,12 70.97,22.29 71,22.32 71,26.75 70.88,26.87 70.74,26.87 70.37,27.24 70.37,27.76 70.75,28.14 70.75,29.25 70.5,29.5 v44,29.5
  Bottom 0.2: 38.5,39.25 39.25,40 IC4.9 38.5,39.25 | 38.5,39.25 37,37.75 36.25,37.75 34,40 IC4.11 | v44,29.5 44,33.25 38.75,39.25 38.5,39.25 | 120.75,31.75 IC9.4 120.57,31.93 124.25,28.25 v124.25,25.75
SND_JOY_ADDR_AND_OUT_AND_A0  (via drill 0.35)
  Top 0.2: 41.5,46.85 41.5,47 | 41.5,46.85 v41.5,43.5 | v79.75,36 79.25,36 79.25,40.5 75.5,44.25 57,44.25 54.25,47 41.65,47 41.5,46.85
  Bottom 0.2: v41.5,43.5 41.5,40.25 IC4.8 | v79.75,36 82.5,33.25 82.5,32.5 IC5.3
SND_JOY_ADDR_AND_OUT_AND_A0(*)  (via drill 0.35)
  Top 0.2: v85.25,36 87.75,38.5 93.5,38.5 96.25,41.25 131.25,41.25 139,49 139,53 138,54 135.25,54 134.25,55 122.75,55 121.75,54 U4.P5 121.75,53.75 121.75,51.5 U4.P6
  Bottom 0.2: v85.25,36 85.25,32.5 IC5.4
SND_JOY_ADDR_AND_OUT_AND_NOT_A0  (via drill 0.35)
  Top 0.2: v101.5,43 81.75,43 81.75,39 82.25,38.5 83.75,38.5 85.25,40 IC5.11 | IC9.6 125.5,32 121.75,35.75 107.64,35.75 106.5,36.89 106.5,38 104,40.25 v104,40.5
  Bottom 0.2: v104,40.5 v101.5,43
SND_JOY_ADDR_AND_OUT_AND_NOT_A0(*)  (via drill 0.35)
  Top 0.2: IC5.10 88,40.25 89.5,41.75 129.25,41.75 136.5,49 136.5,50.5 137.75,50.5 138.25,51 138.25,52.5 v137.5,53.25 | U11.P6 141.5,70.5 139,70.5 U11.P5
  Bottom 0.2: v137.5,53.25 139.25,55 139.25,70.25 139,70.5 U11.P5
SNDOUT1
  Top 0.2: U11.P7 144,70.5 144,67.5 143.75,67.5 C27.+
SNDOUT2
  Top 0.2: U4.P7 121.75,49 122,49.25 127.75,49.25 128.25,49.75 134.75,49.75 135,49.5 C1.+
SYSRES(*)  (via drill 0.35)
  Top 0.2: v70,41.5 70,37.25 54.25,37.25 54,37.5 50.75,37.5 49,35.75 34.5,35.75 33.75,36.5 22.61,36.5 19.87,33.76 19.87,32.62 18.5,31.25 6.75,31.25 6,30.5 6,17.5 7,17.5 7.25,17.25 U$1.P$2
  Bottom 0.2: v70,41.5 70,46.5 66.65,49.85 66.65,59.85 65.81,60.69 U2.P34 65.75,60.5
TMS9118_RW(*)_TMS4416_W(*)  (via drill 0.35)
  Top 0.2: v87.5,66.5 87.5,68.75 86.5,69.75 61.5,69.75 55.5,75.75 U2.P11 | v100.75,51.5 96.25,56 92.75,56 91.75,57 U1.4 | v111,37.25 v113.75,37.25
  Bottom 0.2: 91.75,57.25 U1.4 91.59,58.66 88,62.25 88,66 v87.5,66.5 | v100.75,51.5 101.5,50.75 101.5,46 105.75,41.75 109,41.75 110.5,40.25 110.5,37.75 v111,37.25 | U3.4 120.25,27.5 120.25,29.75 119,31 119,33 114.75,37.25 v113.75,37.25
TMS9918_AD0-TMS4416_A7
  Bottom 0.2: U3.10 107.5,20 105.75,20 96.5,29.25 96.5,39.25 89.5,46.25 82.25,46.25 79,49.5 U1.10 78.75,49.25 78.25,49.25 75,46 71,46 67,50 67,61 58,70 58,75.75 U2.P10
TMS9918_AD1-TMS4416_A6  (via drill 0.35)
  Top 0.2: 86.5,57.25 U1.6 86.51,57.49 85.5,58.5 71,58.5 69.5,60 69.5,60.83 68.57,61.76 67.75,61.76 v66.5,63 | v95.75,43.75 v94.5,45 | v99.5,38.75 v101.25,37
  Bottom 0.2: v66.5,63 66.5,64.75 60.5,70.75 U2.P9 | v94.5,45 90.11,49.38 90.11,52.49 86.51,56.09 U1.6 | v95.75,43.75 97.75,41.75 97.75,41.5 99.5,39.75 v99.5,38.75 | v101.25,37 101.25,35.75 106.75,30.25 106.75,29.75 108.02,28.48 108.08,28.48 108.7,27.86 108.7,26.3 109.75,25.25 114.25,25.25 115.25,26.25 U3.6
TMS9918_AD2-TMS4416_A5  (via drill 0.35)
  Top 0.2: v84.75,60.5 83.25,62 69.75,62 68.75,63 v68.25,63 | v98.5,54.75 98.5,56.25 97.73,57.02 97.73,57.54 97.11,58.16 88.31,58.16 87.7,57.55 87.7,56.2 87.5,56 85,56 84,57 U1.7 | v104.5,38 v102.5,40
  Bottom 0.2: v84.75,60.5 84.75,57.75 84,57 U1.7 | v98.5,54.75 97.25,53.5 97.25,53 97.75,52.5 98.25,52.5 100.5,50.25 100.5,42.04 100.75,41.79 100.75,41.75 v102.5,40 | U2.P8 63,75.88 63,70.75 68.25,65.5 v68.25,63 | U3.7 112.72,27.78 104.5,36 v104.5,38
TMS9918_AD3-TMS4416_A4  (via drill 0.35)
  Top 0.2: U1.8 81.5,57 83.5,55 v90,55 | v78.5,70.5 71,70.5 65.75,75.75 U2.P7 | v101,39.5 v102.75,37.75 | v95.25,46.75 94.25,46.75 v92.75,48.25 | v108.25,30.5 v106.5,32.25
  Bottom 0.2: v78.5,70.5 78.5,70 83,65.5 83,60.25 81.25,58.5 81.25,57.25 U1.8 | v90,55 92.5,55 92.75,54.75 v92.75,48.25 | U3.8 110.18,28.07 108.5,29.75 108.5,30.25 v108.25,30.5 | v106.5,32.25 103.5,35.25 103.5,37 v102.75,37.75 | v95.25,46.75 95.5,46.5 95.5,46.25 98.8,42.95 98.8,42.2 100.75,40.25 100.75,39.75 v101,39.5
TMS9918_AD4-TMS4416_A3  (via drill 0.35)
  Top 0.2: v68.25,52.5 70,50.75 80,50.75 81.25,49.5 U1.11
  Bottom 0.2: U3.11 110,20 106.75,23.25 103,23.25 97,29.25 97,39.25 89.5,46.75 84.25,46.75 81.5,49.5 U1.11 | v68.25,52.5 68.25,53.5 69.5,54.75 69.5,69.25 68,70.75 68,75.8 U2.P6
TMS9918_AD5-TMS4416_A2  (via drill 0.35)
  Top 0.2: v100.5,32.75 v100.5,31 | v77.75,51.75 v82.5,51.75
  Bottom 0.2: U3.12 112.5,20 107.75,24.75 106.25,24.75 104.5,26.5 102.75,26.5 100.5,28.75 v100.5,31 | U2.P5 70.5,75.75 70.5,71 79,62.5 80.75,62.5 82,61.25 82,60.25 80,58.25 78.5,58.25 77.75,57.5 v77.75,51.75 | v100.5,32.75 97.5,35.75 97.5,39.25 89.5,47.25 86.25,47.25 84,49.5 U1.12 83.97,49.53 82.5,51 v82.5,51.75
TMS9918_AD6-TMS4416_A1  (via drill 0.35)
  Top 0.2: v84.25,51.75 v85.75,51.75
  Bottom 0.2: U1.13 86.75,49.25 88.25,47.75 89.5,47.75 97.85,39.4 97.85,37.15 99,36 104.75,30.25 104.75,27.5 107,25.25 107.8,25.25 112.19,20.86 113.16,20.86 114.23,19.8 U3.13 | U2.P4 73.25,75.75 73.25,70.75 82.5,61.5 82.5,60.25 80,57.75 80,56 v84.25,51.75 | 86.5,49.5 U1.13 | U1.13 | U1.13 86.51,49.99 85.75,50.75 v85.75,51.75
TMS9918_AD7-TMS4416_A0  (via drill 0.35)
  Top 0.2: v82.75,68 v85.5,65.5
  Bottom 0.2: 117.75,20 U3.14 116.77,19.8 115.35,21.22 112.33,21.22 107.95,25.6 107.9,25.6 107.75,25.75 107,25.75 105.5,27.25 105.5,29.97 105.1,30.37 105.1,30.4 99.35,36.15 98.25,37.25 98.25,39.46 98.27,39.48 89.05,48.7 U1.14 89.25,49.5 89.25,52.85 85.44,56.66 85.44,57.54 86,58.1 86,65 v85.5,65.5 | 75.75,75.75 U2.P3 75.75,75 v82.75,68
TRIGGER  (via drill 0.35)
  Top 0.2: R2.2 90,67 95.5,72.5 98.25,72.5 JOYSTICK.6 | v99.75,59 99.75,58.5 v103.25,55
  Bottom 0.2: IC8.11 114.5,43.5 112,43.5 108,47.5 105.75,47.5 101,52.25 v103.25,55 | R2.2 90,66.75 91.25,65.5 91.25,64.25 93.75,61.75 97,61.75 v99.75,59
UP  (via drill 0.35)
  Top 0.2: R10.2 92.75,67 95.25,69.5 96.75,69.5 JOYSTICK.1 | v94.25,63 106.5,63 107,63.5 IC8.2
  Bottom 0.2: v94.25,63 94.25,65.25 92.75,66.75 R10.2
VCC  (via drill 0.35)
  Top 0.2: C21.1 U4.P16 129.25,64 127.25,66 v122,66 | C2.1 117.86,66.27 IC8.20 114.5,66.25 109,66.25 108,67.25 104.25,67.25 103.5,66.5 R11.1 103.25,66.5 101,64.25 R7.1 R8.1 R9.1 R10.1 R2.1 | U1.9 C20.1 75.5,57.25 63.5,57.25 63.25,57.5 C14.1 | U2.P33 C14.1 | IC7.14 31,52.82 | 31,52.82 C24.1 29,53 26.25,53 26.25,58 | C15.1 IC4.14 26.5,40.25 28.5,42.25 31.13,42.25 | C6.1 IC1.14 26.5,27.5 28,29 42,29 42.25,28.75 43,28.75 | IC3.14 C13.1 47.75,27.5 46.5,28.75 43,28.75 | C12.1 IC2.14 | U11.P16 C23.1 | IC5.14 77.41,39.87 C17.1 73.75,40 71.5,42.25 48,42.25 | IC10.20 26.25,67.93 | 26.25,67.93 27.41,67.93 C4.1 | C3.1 109.09,39.61 IC9.14 113,39.5 116.25,36.25 134.25,36.25 137,33.5 | 26.25,58 26.25,67.93 | 31.13,42.25 48,42.25 | 63,58 C14.1 | 137,33.5 137,29 | 137,29 137,23.75 REG2.P$3 | 137,33.5 138.5,33.5 C11.+ | 137,29 109.25,29 107.75,27.5 U3.9 C22.1 103.75,27.5 102.25,29 79.25,29 77.75,27.5 IC6.14 C16.1 73.75,27.5 71,30.25 43,30.25 43,28.75 | v48,42.5 48,42.25 | C14.1 62.1,57.65 61.75,58 26.5,58 26.25,58 | 31.13,42.25 31,42.38 31,52.82
  Bottom 0.2: C21.1 132.75,64 135,61.75 135,58.5 Q2.C 135,58.25 133.5,56.75 133.5,39 138.75,33.75 C11.+ | C23.1 124.75,78 118.5,71.75 118.5,66.75 118,66.25 118.05,66.11 | 118.05,66.11 C2.1 | C6.1 22.5,27.25 22.5,26.12 21.64,25.26 21.64,24.5 22.5,23.64 22.5,14.06 30.17,6.39 SW1.P$15 | C13.1 47.75,27.5 47.75,28 45.75,30 45.75,38 47.75,40 C12.1 48,40.25 v48,42.5 | IC6.14 77.5,27.25 77.5,26.25 76,24.75 76,14.75 78.59,12.16 78.59,10.75 SW3.P$15 | v122,66 118.16,66 118.05,66.11
VDP-RD0  (via drill 0.35)
  Top 0.2: U2.P32 60.75,60.75 62.72,62.72 64.33,62.72 65.24,63.63 84.51,63.63 87.64,60.5 v93.5,60.5
  Bottom 0.2: v93.5,60.5 96.75,57.25 U1.2
VDP-RD1  (via drill 0.35)
  Top 0.2: v94.25,54.25 78.25,54.25 77,55.5 75.75,55.5 75,56.25 61,56.25 v60,57.25
  Bottom 0.2: v94.25,54.25 94.25,57 U1.3 | v60,57.25 59.75,57.25 58,59 58,60.66 U2.P31
VDP-RD2  (via drill 0.35)
  Top 0.2: U1.15 91.5,49.25 90.5,48.25 78.5,48.25 76.75,50 61.5,50 v59,52.5
  Bottom 0.2: U2.P30 55.43,57.12 59,53.55 v59,52.5
VDP-RD3  (via drill 0.35)
  Top 0.2: U1.17 96.5,49.5 93.25,52.75 72.75,52.75 71.5,54 62.1,54 58.6,57.5 53.25,57.5 v53,57.25
  Bottom 0.2: v53,57.25 53,60.5 U2.P29
VDP-RD4  (via drill 0.35)
  Top 0.2: v76,31.75 77.5,30.25 95.5,30.25 98.63,33.38 100.76,33.38 100.77,33.37 112.26,33.37 112.64,33.75 113.25,33.75 114.58,32.42 114.58,30.95 115.11,30.42 120.95,30.42 121.02,30.48 121.75,29.75 v125.25,29.75 | v52,46.25 53.12,45.13 54.01,45.13 55.64,43.5 v66.75,43.5
  Bottom 0.2: v66.75,43.5 72.25,38 72.25,35.5 v76,31.75 | U2.P28 50.5,60.5 50.5,47.75 v52,46.25 | U3.2 125.42,29.58 v125.25,29.75
VDP-RD5  (via drill 0.35)
  Top 0.2: v86.5,28.25 86.5,25.75 103.25,25.75 103.75,26.25 121.75,26.25 122.75,27.25 U3.3 | v59.75,54.75 59.75,55 v58,56.75
  Bottom 0.2: v86.5,28.25 85,29.75 77,29.75 71.75,35 71.75,37.5 65,44.25 65,48.53 64.28,49.25 64.25,49.25 60,53.5 60,54.5 v59.75,54.75 | U2.P27 48,60.75 49.75,62.5 56.25,62.5 56.5,62.25 56.5,58.25 v58,56.75
VDP-RD6  (via drill 0.35)
  Top 0.2: v64.75,35.75 65.25,35.25 91.5,35.25 92.38,36.13 93.01,36.13 93.14,36 v105.75,36
  Bottom 0.2: v64.75,35.75 53.75,35.75 50,39.5 50,56 45.5,60.5 U2.P26 | v105.75,36 112.75,29 115.25,29 116.5,27.75 116.5,24 120.5,20 U3.15
VDP-RD7  (via drill 0.35)
  Top 0.2: v47.5,55.75 52.25,51 v55.5,51 | U3.17 125.25,19.75 125.25,14.25 123.5,12.5 90.75,12.5 88.75,14.5 81,14.5 71.5,24 71.5,27 v71,27.5
  Bottom 0.2: v47.5,55.75 42.75,60.5 U2.P25 | v71,27.5 71.25,27.75 71.25,31.75 66,37 66,41.75 62,45.75 61.5,45.75 60.75,46.5 60.75,49.25 59,51 v55.5,51
VDP_ADDR
  Top 0.2: IC4.2 29,32.5 30.75,34.25 36.53,34.25 | 36.5,32.5 IC4.5 36.52,34.23 36.53,34.25 | 36.53,34.25 62.25,34.25 63.25,33.25 63.5,33.25 64.25,32.5 IC2.6
VDP_ADDR(*)
  Bottom 0.2: 62,32.5 IC2.5 62.5,31.92 62.5,31.5 64.25,29.75 66.25,29.75 67,29 IC3.8 67,27.5
VDP_ADDR_AND_IN
  Top 0.2: IC5.1 75.25,32.5 73.5,30.75 41,30.75 39.25,32.5 IC4.6
VDP_ADDR_AND_IN(*)  (via drill 0.35)
  Top 0.2: v69.25,43.5 v75.25,43.5
  Bottom 0.2: v69.25,43.5 69.25,46.5 61.25,54.5 61.25,58.25 59.25,60.25 59.25,66 53,72.25 49,72.25 45.5,75.75 U2.P15 | 80,32.5 IC5.2 80.2,33.55 76.5,37.25 76.5,42.25 v75.25,43.5
VDP_ADDR_AND_OUT  (via drill 0.35)
  Top 0.2: v33.75,35.5 34,35.25 52.25,35.25 v53.75,36.75
  Bottom 0.2: v33.75,35.5 31.5,33.25 31.5,32.5 IC4.3 | v53.75,36.75 53.75,39.5 54.25,40 IC2.13
VDP_ADDR_AND_OUT(*)  (via drill 0.35)
  Top 0.2: v50.25,73.5 49.75,73 49.75,70.75 54.25,66.25 v54.25,59.5
  Bottom 0.2: v54.25,59.5 54.25,47 56.75,44.5 56.75,40.25 IC2.12 | v50.25,73.5 v50.24,73.5 U2.P14
VOLTAGE-IN
  Top 0.508: J1.3 140.66,14.72 140.44,14.94 | 140.44,14.94 REG2.P$1 | 140.44,14.94 140.44,13.74 C5.+
XTAL1  (via drill 0.35)
  Top 0.2: Q1.1 62.25,47.5 66.5,47.5 C8.2 66.75,47.75 67.75,48.75 72,48.75 v72.5,49.25
  Bottom 0.2: v72.5,49.25 77.25,54 77.25,57.75 78.25,58.75 79,58.75 80.75,60.5 U2.P40
XTAL2  (via drill 0.35)
  Top 0.2: Q1.2 57,47.75 57,53 C9.2 57.25,53.25 v69.5,53.25
  Bottom 0.2: v69.5,53.25 75,58.75 76.5,58.75 78.25,60.5 U2.P39

### Text on the board
tNames: TMS9918 / TMS9118 | TMS4416 | TRACO / +5V | TMS4416 | VDP Port Address | (Bit 0 must remain 0) | Audio/Joystick Address | (Bit 0 must remain 0) | A0 | A1 | A2 | A3 | A4 | A5 | A6 | A7 | A0 | A1 | A2 | A3 | A4 | A5 | A6 | A7